# EAGLE design 477ProjectSchematic (EAGLE 6.4)
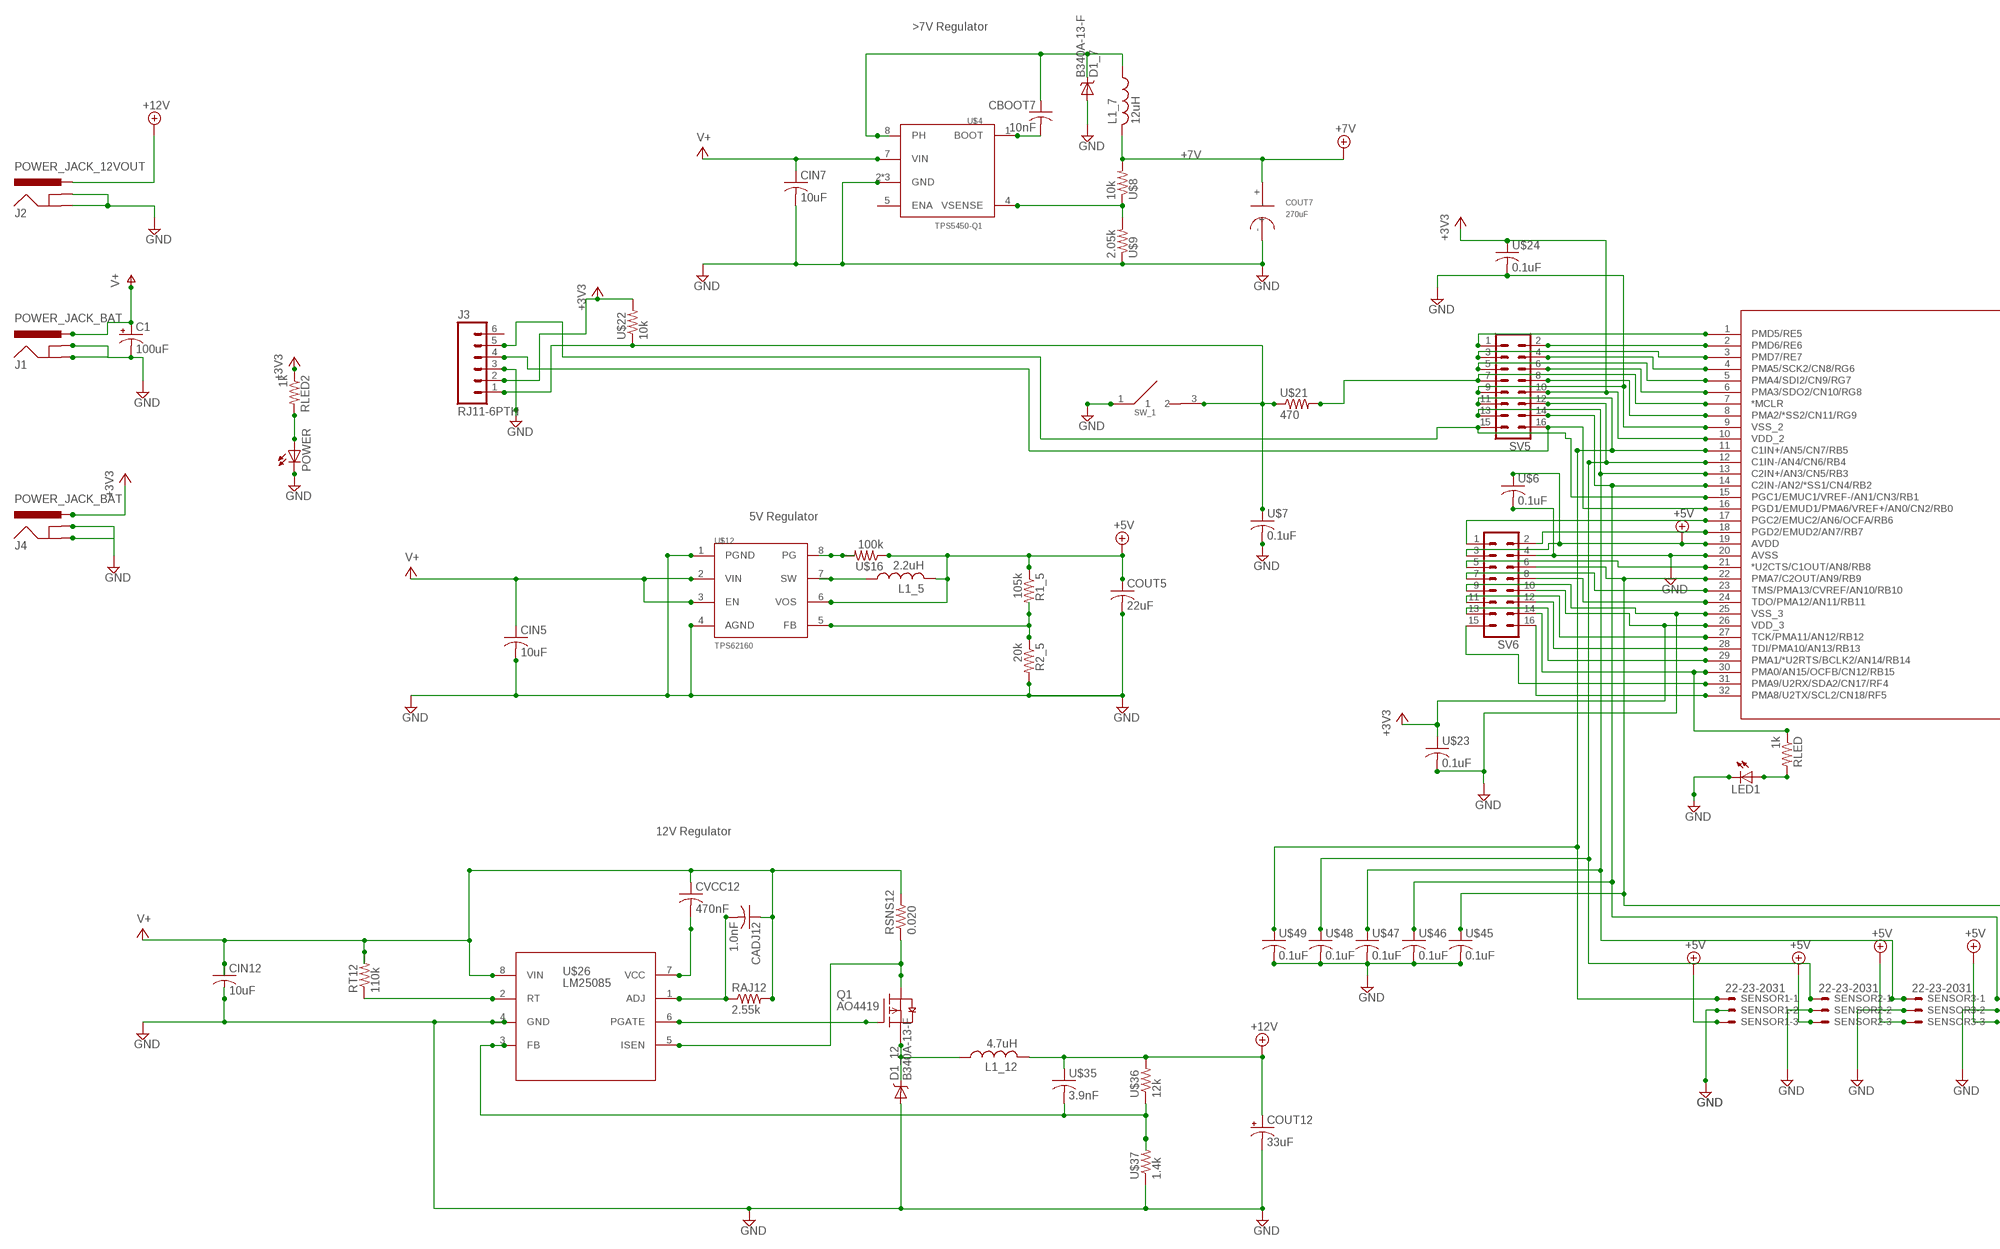
[diagram p0: schematic, sheet 1, part 1 of 2]
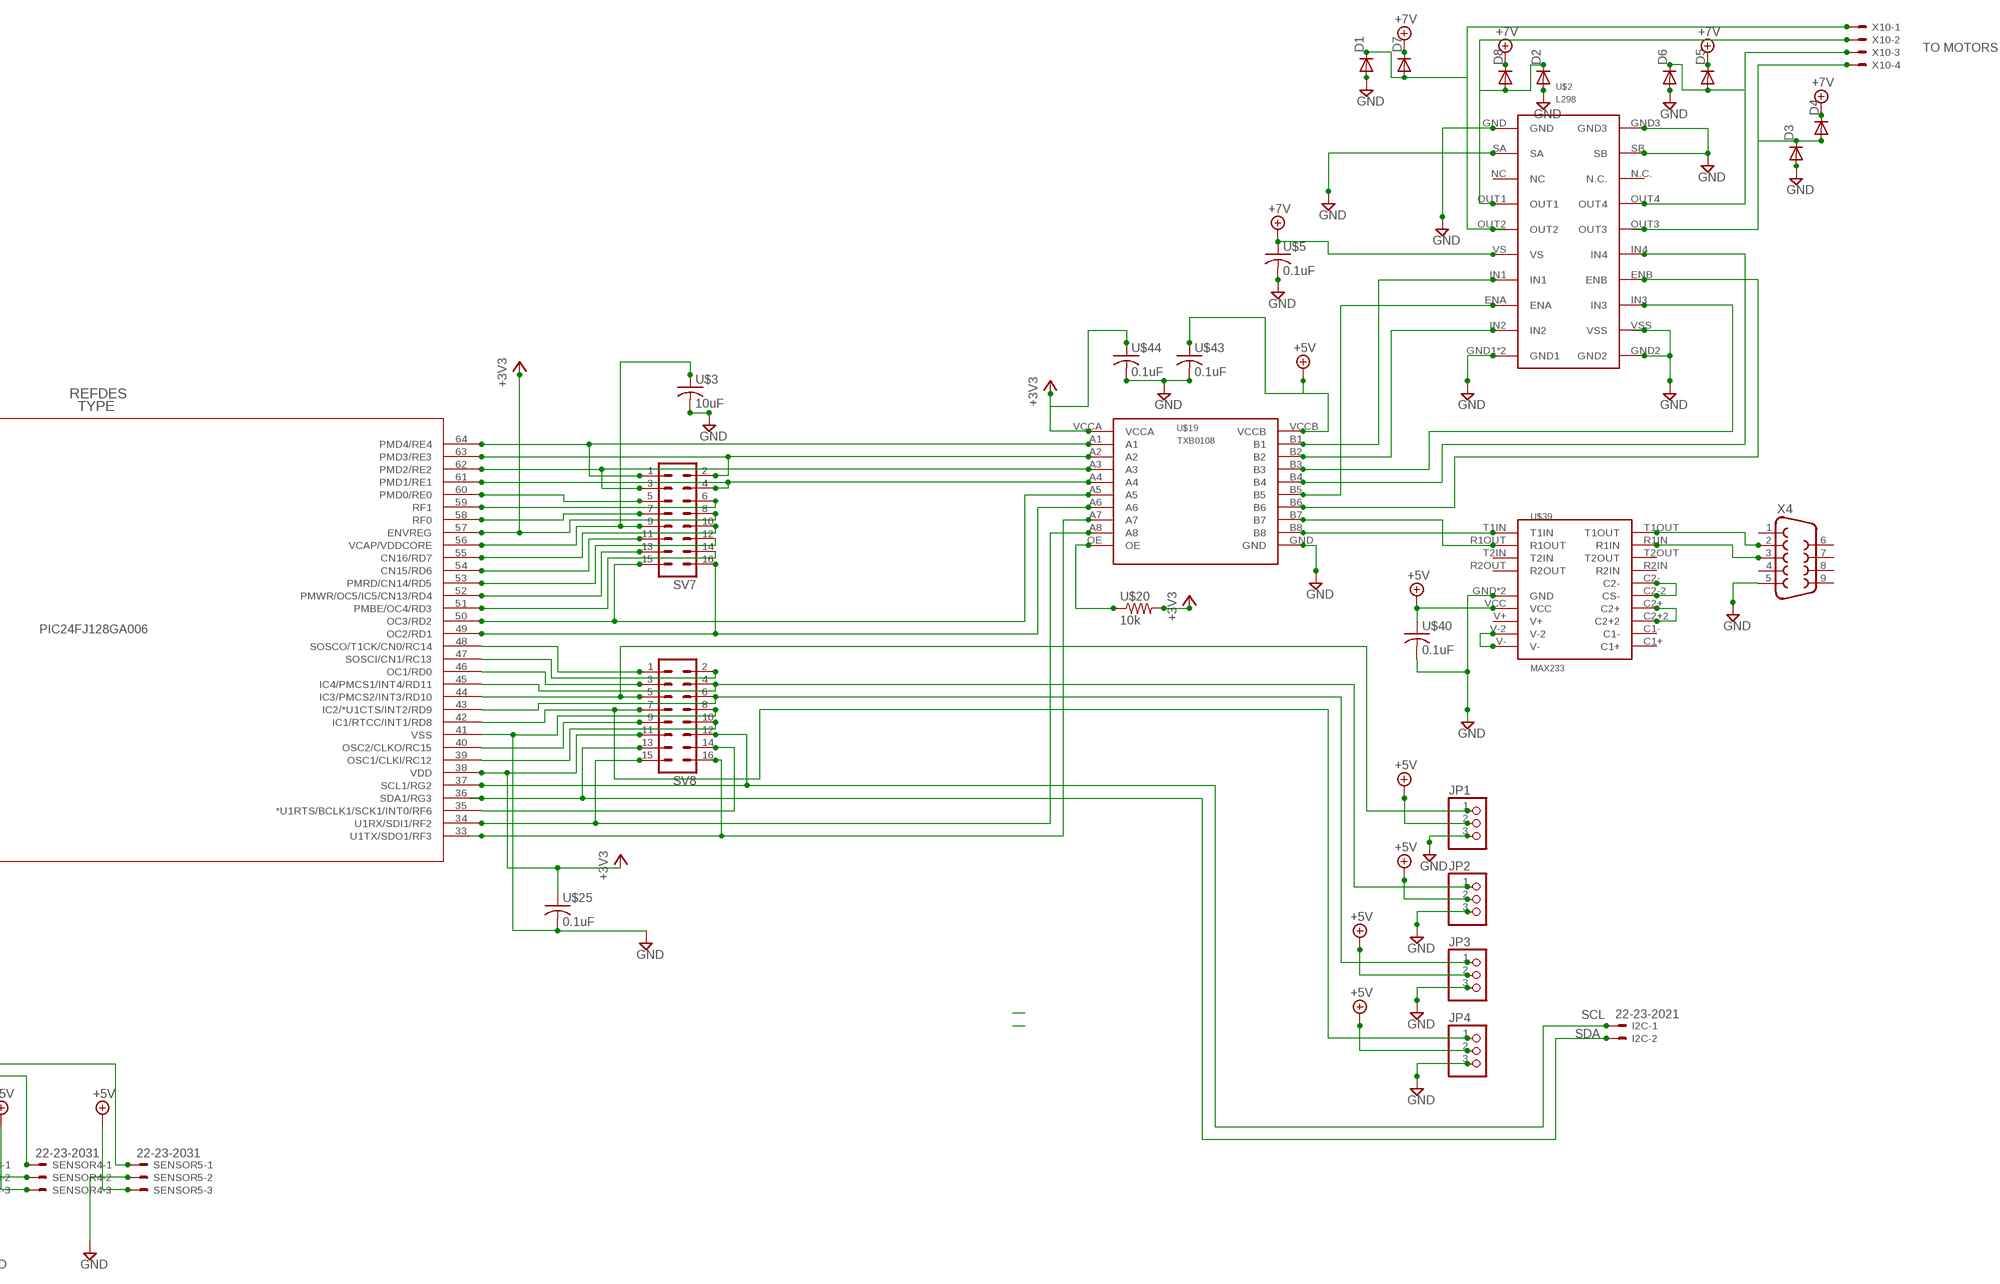
[diagram p1: schematic, sheet 1, part 2 of 2]

## Parts
C1  100uF  CPOL-USE3.5-8  [E3,5-8]
CADJ12  1.0nF  C-US-1206  [C1206]
CBOOT7  10nF  C-US-1206  [C1206]
CIN5  10uF  C-US-1206  [C1206]
CIN7  10uF  C-US-1210  [C1210]
CIN12  10uF  C-US-1210  [C1210]
COUT5  22uF  C-US-1206  [C1206]
COUT7  270uF  APXA100ARA271MJ80G  [CAPSMT_62_J80]
COUT12  33uF  T495D336K025ATE090  [D/7343-31W]
CVCC12  470nF  C-US-1206  [C1206]
D1  DIODE-DO-214AC  [DO-214AC]
D1_7  B340A-13-F  [SMA-DIODE]
D1_12  B340A-13-F  [SMA-DIODE]
D2  DIODE-DO-214AC  [DO-214AC]
D3  DIODE-DO-214AC  [DO-214AC]
D4  DIODE-DO-214AC  [DO-214AC]
D5  DIODE-DO-214AC  [DO-214AC]
D6  DIODE-DO-214AC  [DO-214AC]
D7  DIODE-DO-214AC  [DO-214AC]
D8  DIODE-DO-214AC  [DO-214AC]
I2C  22-23-2021  [22-23-2021]
J1  POWER_JACK_BAT  POWER_JACKPTH  [POWER_JACK_PTH]
J2  POWER_JACK_12VOUT  POWER_JACKPTH  [POWER_JACK_PTH]
J3  RJ11-6PTH  [RJ11-6]
J4  POWER_JACK_BAT  POWER_JACKPTH  [POWER_JACK_PTH]
JP1  PINHD-1X3  [1X03]
JP2  PINHD-1X3  [1X03]
JP3  PINHD-1X3  [1X03]
JP4  PINHD-1X3  [1X03]
L1_5  2.2uH  SDR0403  [SDR0403]
L1_7  12uH  SRR1210  [SRR1210]
L1_12  4.7uH  SLF10165T-4R7N4R73PF  [SLF10165]
LED1  LEDSMT1206  [1206]
POWER  LEDSMT1206  [1206]
Q1  AO4419  [SOIC8]
R1_5  105k  R-US"  [R1206]
R2_5  20k  R-US"  [R1206]
RAJ12  2.55k  R-US"  [R1206]
RLED  1k  R-US"  [R1206]
RLED2  1k  R-US"  [R1206]
RSNS12  0.020  R-US"  [R1206]
RT12  110k  R-US"  [R1206]
SENSOR1  22-23-2031  [22-23-2031]
SENSOR2  22-23-2031  [22-23-2031]
SENSOR3  22-23-2031  [22-23-2031]
SENSOR4  22-23-2031  [22-23-2031]
SENSOR5  22-23-2031  [22-23-2031]
SV5  MA08-2  [MA08-2]
SV6  MA08-2  [MA08-2]
SV7  MA08-2  [MA08-2]
SV8  MA08-2  [MA08-2]
SW_1  RESET_BUTTON  [TACTILE-PTH-12MM]
U$1  PIC24FJ128GA006-  [TQFP64_10X10MC]
U$2  L298  [L298]
U$3  10uF  C-US-1206  [C1206]
U$4  TPS5450-Q1  [PSOP-8]
U$5  0.1uF  C-US-1206  [C1206]
U$6  0.1uF  C-US-1206  [C1206]
U$7  0.1uF  C-US-1206  [C1206]
U$8  10k  R-US"  [R1206]
U$9  2.05k  R-US"  [R1206]
U$12  TPS62160  [MSOP-8]
U$16  100k  R-US"  [R1206]
U$19  TXB0108  [TXB0108]
U$20  10k  R-US"  [R1206]
U$21  470  R-US"  [R1206]
U$22  10k  R-US"  [R1206]
U$23  0.1uF  C-US-1206  [C1206]
U$24  0.1uF  C-US-1206  [C1206]
U$25  0.1uF  C-US-1206  [C1206]
U$26  LM25085  [MSOP-8]
U$35  3.9nF  C-US-1206  [C1206]
U$36  12k  R-US"  [R1206]
U$37  1.4k  R-US"  [R1206]
U$39  MAX233  [SOIC-20]
U$40  0.1uF  C-US-1206  [C1206]
U$43  0.1uF  C-US-1206  [C1206]
U$44  0.1uF  C-US-1206  [C1206]
U$45  0.1uF  C-US-1206  [C1206]
U$46  0.1uF  C-US-1206  [C1206]
U$47  0.1uF  C-US-1206  [C1206]
U$48  0.1uF  C-US-1206  [C1206]
U$49  0.1uF  C-US-1206  [C1206]
X4  DB9FEMALE  [DB9]
X10  22-23-2041  [22-23-2041]

## Nets
+3V3: J3.2 J4.PWR RLED2.1 SV5.10 SV6.10 SV7.8 SV8.11 U$1.10(VDD_2) U$1.26(VDD_3) U$1.38(VDD) U$1.57(ENVREG) U$19.VCCA U$20.2 U$22.2 U$23.1 U$24.1 U$25.1 U$44.1
+5V: COUT5.1 JP1.2 JP2.2 JP3.2 JP4.2 L1_5.B R1_5.1 SENSOR1.3 SENSOR2.3 SENSOR3.3 SENSOR4.3 SENSOR5.3 SV6.3 U$1.19(AVDD) U$6.1 U$12.6(VOS) U$16.1 U$19.VCCB U$39.VCC U$40.1 U$43.1
+7V: COUT7.+ D4.C D5.C D7.C D8.C L1_7.B U$2.VS U$5.1 U$8.2
+12V: COUT12.+ J2.PWR L1_12.2 U$35.1 U$36.2
GND: C1.- CIN5.2 CIN7.2 CIN12.2 COUT5.2 COUT7.- COUT12.- D1.A D1_7.- D1_12.- D2.A D3.A D6.A J1.GND J1.GNDBREAK J2.GND J2.GNDBREAK J3.3 J4.GND J4.GNDBREAK JP1.3 JP2.3 JP3.3 JP4.3 LED1.C POWER.C R2_5.2 SENSOR1.2 SENSOR2.2 SENSOR3.2 SENSOR4.2 SENSOR5.2 SV5.9 SV6.4 SV6.9 SV8.8 SW_1.1 U$1.9(VSS_2) U$1.20(AVSS) U$1.25(VSS_3) U$1.41(VSS) U$2.GND U$2.GND1 U$2.GND2 U$2.GND3 U$2.GNDPAD(GND1) U$2.SA U$2.SB U$2.VSS U$3.2 U$4.2(GND) U$4.6(GND) U$4.PAD(GND) U$5.2 U$6.2 U$7.2 U$9.1 U$12.1(PGND) U$12.4(AGND) U$19.GND U$23.2 U$24.2 U$25.2 U$26.4(GND) U$37.1 U$39.GND U$39.GND2(GND) U$40.2 U$43.2 U$44.2 U$45.2 U$46.2 U$47.2 U$48.2 U$49.2 X4.5
N$1: SENSOR1.1 SV5.11 U$1.11(C1IN+/AN5/CN7/RB5) U$49.1
N$2: SENSOR2.1 SV5.12 U$1.12(C1IN-/AN4/CN6/RB4) U$48.1
N$3: SENSOR3.1 SV5.13 U$1.13(C2IN+/AN3/CN5/RB3) U$47.1
N$4: SENSOR4.1 SV5.14 U$1.14(C2IN-/AN2/*SS1/CN4/RB2) U$46.1
N$5: SENSOR5.1 SV6.6 U$1.22(PMA7/C2OUT/AN9/RB9) U$45.1
N$6: SV5.1 U$1.1(PMD5/RE5)
N$7: J3.4 SV5.16 U$1.16(PGD1/EMUD1/PMA6/VREF+/AN0/CN2/RB0)
N$8: SV8.15 U$1.34(U1RX/SDI1/RF2) U$19.A8
N$9: SV8.16 U$1.33(U1TX/SDO1/RF3) U$19.A7
N$10: SV6.1 U$1.17(PGC2/EMUC2/AN6/OCFA/RB6)
N$11: SV5.2 U$1.2(PMD6/RE6)
N$12: JP3.1 SV8.6 U$1.43(IC2/*U1CTS/INT2/RD9)
N$13: U$39.V- U$39.V-2
N$14: J3.5 SV5.15 U$1.15(PGC1/EMUC1/VREF-/AN1/CN3/RB1)
N$15: SV7.1 U$1.64(PMD4/RE4) U$19.A1
N$16: CBOOT7.1 D1_7.+ L1_7.A U$4.8(PH)
N$17: SV7.2 U$1.63(PMD3/RE3) U$19.A2
N$18: D2.C D8.A U$2.OUT1 X10.2
N$19: D1.C D7.A U$2.OUT2 X10.1
N$20: D5.A D6.C U$2.OUT4 X10.3
N$21: D3.C D4.A U$2.OUT3 X10.4
N$22: SV6.2 U$1.18(PGD2/EMUD2/AN7/RB7)
N$23: SV5.3 U$1.3(PMD7/RE7)
N$24: SV5.4 U$1.4(PMA5/SCK2/CN8/RG6)
N$25: CBOOT7.2 U$4.1(BOOT)
N$26: SV5.5 U$1.5(PMA4/SDI2/CN9/RG7)
N$27: SV5.6 U$1.6(PMA3/SDO2/CN10/RG8)
N$28: U$4.4(VSENSE) U$8.1 U$9.2
N$29: SV7.3 U$1.62(PMD2/RE2) U$19.A3
N$30: J3.1 SW_1.3 U$7.1 U$21.1 U$22.1
N$31: LED1.A RLED.2
N$32: SV7.4 U$1.61(PMD1/RE1) U$19.A4
N$33: D1_12.+ L1_12.1 Q1.1(S) Q1.2(S) Q1.3(S)
N$34: SV7.15 U$1.50(OC3/RD2) U$19.A5
N$35: U$26.3(FB) U$35.2 U$36.1 U$37.2
N$36: L1_5.A U$12.7(SW)
N$37: U$12.8(PG) U$16.2
N$38: SV7.16 U$1.49(OC2/RD1) U$19.A6
N$39: U$2.IN1 U$19.B1
N$40: R1_5.2 R2_5.1 U$12.5(FB)
N$41: U$2.IN4 U$19.B4
N$42: U$2.IN2 U$19.B2
N$43: U$2.IN3 U$19.B3
N$44: U$2.ENA U$19.B5
N$45: U$2.ENB U$19.B6
N$46: SV6.5 U$1.21(*U2CTS/C1OUT/AN8/RB8)
N$47: U$19.B7 U$39.R1OUT
N$48: RT12.1 U$26.2(RT)
N$49: U$19.B8 U$39.T1IN
N$51: CVCC12.2 U$26.7(VCC)
N$52: CADJ12.2 RAJ12.1 U$26.1(ADJ)
N$53: U$39.T1OUT X4.2
N$54: Q1.5(D) Q1.6(D) Q1.7(D) Q1.8(D) RSNS12.1 U$26.5(ISEN)
N$55: Q1.4(G) U$26.6(PGATE)
N$56: U$19.OE U$20.1
N$57: SV6.7 U$1.23(TMS/PMA13/CVREF/AN10/RB10)
N$59: SV8.1 U$1.48(SOSCO/T1CK/CN0/RC14)
N$61: SV6.8 U$1.24(TDO/PMA12/AN11/RB11)
N$62: U$39.C2- U$39.C2-2(CS-)
N$63: SV6.11 U$1.27(TCK/PMA11/AN12/RB12)
N$64: SV6.12 U$1.28(TDI/PMA10/AN13/RB13)
N$65: SV6.13 U$1.29(PMA1/*U2RTS/BCLK2/AN14/RB14)
N$66: RLED.1 SV6.14 U$1.30(PMA0/AN15/OCFB/CN12/RB15)
N$67: SV7.9 U$1.56(VCAP/VDDCORE) U$3.1
N$68: SV8.2 U$1.47(SOSCI/CN1/RC13)
N$69: SV8.3 U$1.46(OC1/RD0)
N$70: JP2.1 SV8.4 U$1.45(IC4/PMCS1/INT4/RD11)
N$71: JP1.1 SV8.5 U$1.44(IC3/PMCS2/INT3/RD10)
N$72: U$39.C2+ U$39.C2+2
N$73: JP4.1 SV8.7 U$1.42(IC1/RTCC/INT1/RD8)
N$74: SV8.9 U$1.40(OSC2/CLKO/RC15)
N$75: SV8.10 U$1.39(OSC1/CLKI/RC12)
N$76: SV7.11 U$1.54(CN15/RD6)
N$77: SV7.12 U$1.53(PMRD/CN14/RD5)
N$78: POWER.A RLED2.2
N$79: SV5.7 U$1.7(*MCLR) U$21.2
N$81: SV7.13 U$1.52(PMWR/OC5/IC5/CN13/RD4)
N$82: SV7.14 U$1.51(PMBE/OC4/RD3)
N$83: SV8.14 U$1.35(*U1RTS/BCLK1/SCK1/INT0/RF6)
N$87: U$39.R1IN X4.3
N$90: SV6.15 U$1.31(PMA9/U2RX/SDA2/CN17/RF4)
N$91: SV5.8 U$1.8(PMA2/*SS2/CN11/RG9)
N$93: SV6.16 U$1.32(PMA8/U2TX/SCL2/CN18/RF5)
N$94: SV7.10 U$1.55(CN16/RD7)
N$95: SV7.7 U$1.58(RF0)
N$96: SV7.6 U$1.59(RF1)
N$97: SV7.5 U$1.60(PMD0/RE0)
SCL: I2C.1 SV8.12 U$1.37(SCL1/RG2)
SDA: I2C.2 SV8.13 U$1.36(SDA1/RG3)
V+: C1.+ CADJ12.1 CIN5.1 CIN7.1 CIN12.1 CVCC12.1 J1.PWR RAJ12.2 RSNS12.2 RT12.2 U$4.7(VIN) U$12.2(VIN) U$12.3(EN) U$26.8(VIN)
Unconnected: J3.6 U$2.N.C. U$2.NC U$4.5(ENA) U$39.C1+ U$39.C1- U$39.R2IN U$39.R2OUT U$39.T2IN U$39.T2OUT U$39.V+ X4.1 X4.4 X4.6 X4.7 X4.8 X4.9

## Notes on the sheet
- TO MOTORS
- >7V Regulator
- PIC24FJ128GA006
- 5V Regulator
- 12V Regulator
- SCL
- SDA

## Library data of the parts
C1 = rcl:CPOL-US: POLARIZED CAPACITOR, American symbol
CADJ12 CBOOT7 CIN5 COUT5 CVCC12 U$3 U$5-U$7 U$23-U$25 U$35 U$40 U$43-U$49 = MinotaurParts:C-US-1206
CIN7 CIN12 = MinotaurParts:C-US-1210
COUT7 = MinotaurParts:APXA100ARA271MJ80G
COUT12 = MinotaurParts:T495D336K025ATE090: Tantalum capacitor for 12 volt power circuit
D1-D8 = diode:DIODE-: DIODE
D1_7 D1_12 = MinotaurParts:B340A-13-F
I2C = con-molex:22-23-2021: .100" (2.54mm) Center Header - 2 Pin; MF: MOLEX; MPN: 22-23-2021; OC_FARNELL: 1462926; OC_NEWARK: 25C3832
J1 J2 J4 = SparkFun-Connectors:POWER_JACK: Power Jack This is the standard 5.5mm barrel jack for power. The PTH is the most common, proven, reliable, footprint. The Slot footprint only works if the mill layer is transmitted to the PCB fab house so be warned. Spark Fun Electronics SKU : PRT-00119 SMT: CONN-08106 Mating wall wart : TOL-00298 (and others)
J3 = SparkFun-Connectors:RJ11-6: RJ11 Jack Simple 6 pin RJ11 jack. Commonly found on CAT3 devices and Microchip programmers. SKU: PRT-00132
JP1-JP4 = pinhead:PINHD-1X3: PIN HEADER
L1_5 = MinotaurParts:SDR0403
L1_7 = MinotaurParts:SRR1210
L1_12 = MinotaurParts:SLF10165T-4R7N4R73PF: Inductor for the 12V power circuit
LED1 POWER = led:LED: LED OSRAM: - CHIPLED LG R971, LG N971, LY N971, LG Q971, LY Q971, LO R971, LY R971 LH N974, LH R974 LS Q976, LO Q976, LY Q976 LO Q996 - Hyper CHIPLED LW Q18S LB Q993, LB Q99A, LB R99A - SideLED LS A670, LO A670, LY A670, LG A670, LP A670 LB A673, LV A673, LT A673, LW A673 LH A674 LY A675 LS A676, LA A676, LO A676, LY A676, LW A676 LS A679, LY A679, LG A679 - Hyper Micro SIDELED® LS Y876, LA Y876, LO Y876, LY Y876 LT Y87S - SmartLED LW L88C, LW L88S LB L89C, LB L89S, LG L890 LS L89K, LO L89K, LY L89K LS L896, LA L896, LO L896, LY L896 - TOPLED LS T670, LO T670, LY T670, LG T670, LP T670 LSG T670, LSP T670, LSY T670, LOP T670, LYG T670 LG T671, LOG T671, LSG T671 LB T673, LV T673, LT T673, LW T673 LH T674 LS T676, LA T676, LO T676, LY T676, LB T676, LH T676, LSB T676, LW T676 LB T67C, LV T67C, LT T67C, LS T67K, LO T67K, LY T67K, LW E67C LS E67B, LA E67B, LO E67B, LY E67B, LB E67C, LV E67C, LT E67C LW T67C LS T679, LY T679, LG T679 LS T770, LO T770, LY T770, LG T770, LP T770 LB T773, LV T773, LT T773, LW T773 LH T774 LS E675, LA E675, LY E675, LS T675 LS T776, LA T776, LO T776, LY T776, LB T776 LHGB T686 LT T68C, LB T68C - Hyper Mini TOPLED® LB M676 - Mini TOPLED Santana® LG M470 LS M47K, LO M47K, LY M47K Source: http://www.osram.convergy.de LUXEON: - LUMILED® LXK2-PW12-R00, LXK2-PW12-S00, LXK2-PW14-U00, LXK2-PW14-V00 LXK2-PM12-R00, LXK2-PM12-S00, LXK2-PM14-U00 LXK2-PE12-Q00, LXK2-PE12-R00, LXK2-PE12-S00, LXK2-PE14-T00, LXK2-PE14-U00 LXK2-PB12-K00, LXK2-PB12-L00, LXK2-PB12-M00, LXK2-PB14-N00, LXK2-PB14-P00, LXK2-PB14-Q00 LXK2-PR12-L00, LXK2-PR12-M00, LXK2-PR14-Q00, LXK2-PR14-R00 LXK2-PD12-Q00, LXK2-PD12-R00, LXK2-PD12-S00 LXK2-PH12-R00, LXK2-PH12-S00 LXK2-PL12-P00, LXK2-PL12-Q00, LXK2-PL12-R00 Source: www.luxeon.com KINGBRIGHT: KA-3528ASYC Source: www.kingbright.com
Q1 = MinotaurParts:AO4419: P-Channel MOSFET -30V; -9.7A; USE IN 12V regulator circuit
R1_5 R2_5 RAJ12 RLED RLED2 RSNS12 RT12 U$8 U$9 U$16 U$20-U$22 U$36 U$37 = MinotaurParts:R-US: Surface mount resistor
SENSOR1-SENSOR5 = con-molex:22-23-2031: .100" (2.54mm) Center Header - 3 Pin; MF: MOLEX; MPN: 22-23-2031; OC_FARNELL: 1462950; OC_NEWARK: 30C0862
SV5-SV8 = con-lstb:MA08-2: PIN HEADER; OC_FARNELL: unknown; OC_NEWARK: unknown
SW_1 = MinotaurParts:RESET_BUTTON
U$1 = MinotaurParts:PIC24FJ128GA006-
U$2 = MinotaurParts:L298: H bridge motor driver
U$4 = MinotaurParts:TPS5450-Q1
U$12 = MinotaurParts:TPS62160: adjustable switching regulator for the 3.3 volt and 5 volt rails
U$19 = MinotaurParts:TXB0108: 3.3 - 5 volt level converter
U$26 = MinotaurParts:LM25085
U$39 = MinotaurParts:MAX233: RS232 level converter
X4 = SparkFun-Connectors:DB9: DB9 Connector Standard DB9 (D-Sub 9) serial connector. Can be used for CAN bus as well as RS485 and RS232. Footprint production proven. Spark Fun Electronics SKU : PRT-00429
X10 = con-molex:22-23-2041: .100" (2.54mm) Center Header - 4 Pin; MF: MOLEX; MPN: 22-23-2041; OC_FARNELL: 1462920; OC_NEWARK: 38C0355

## Board
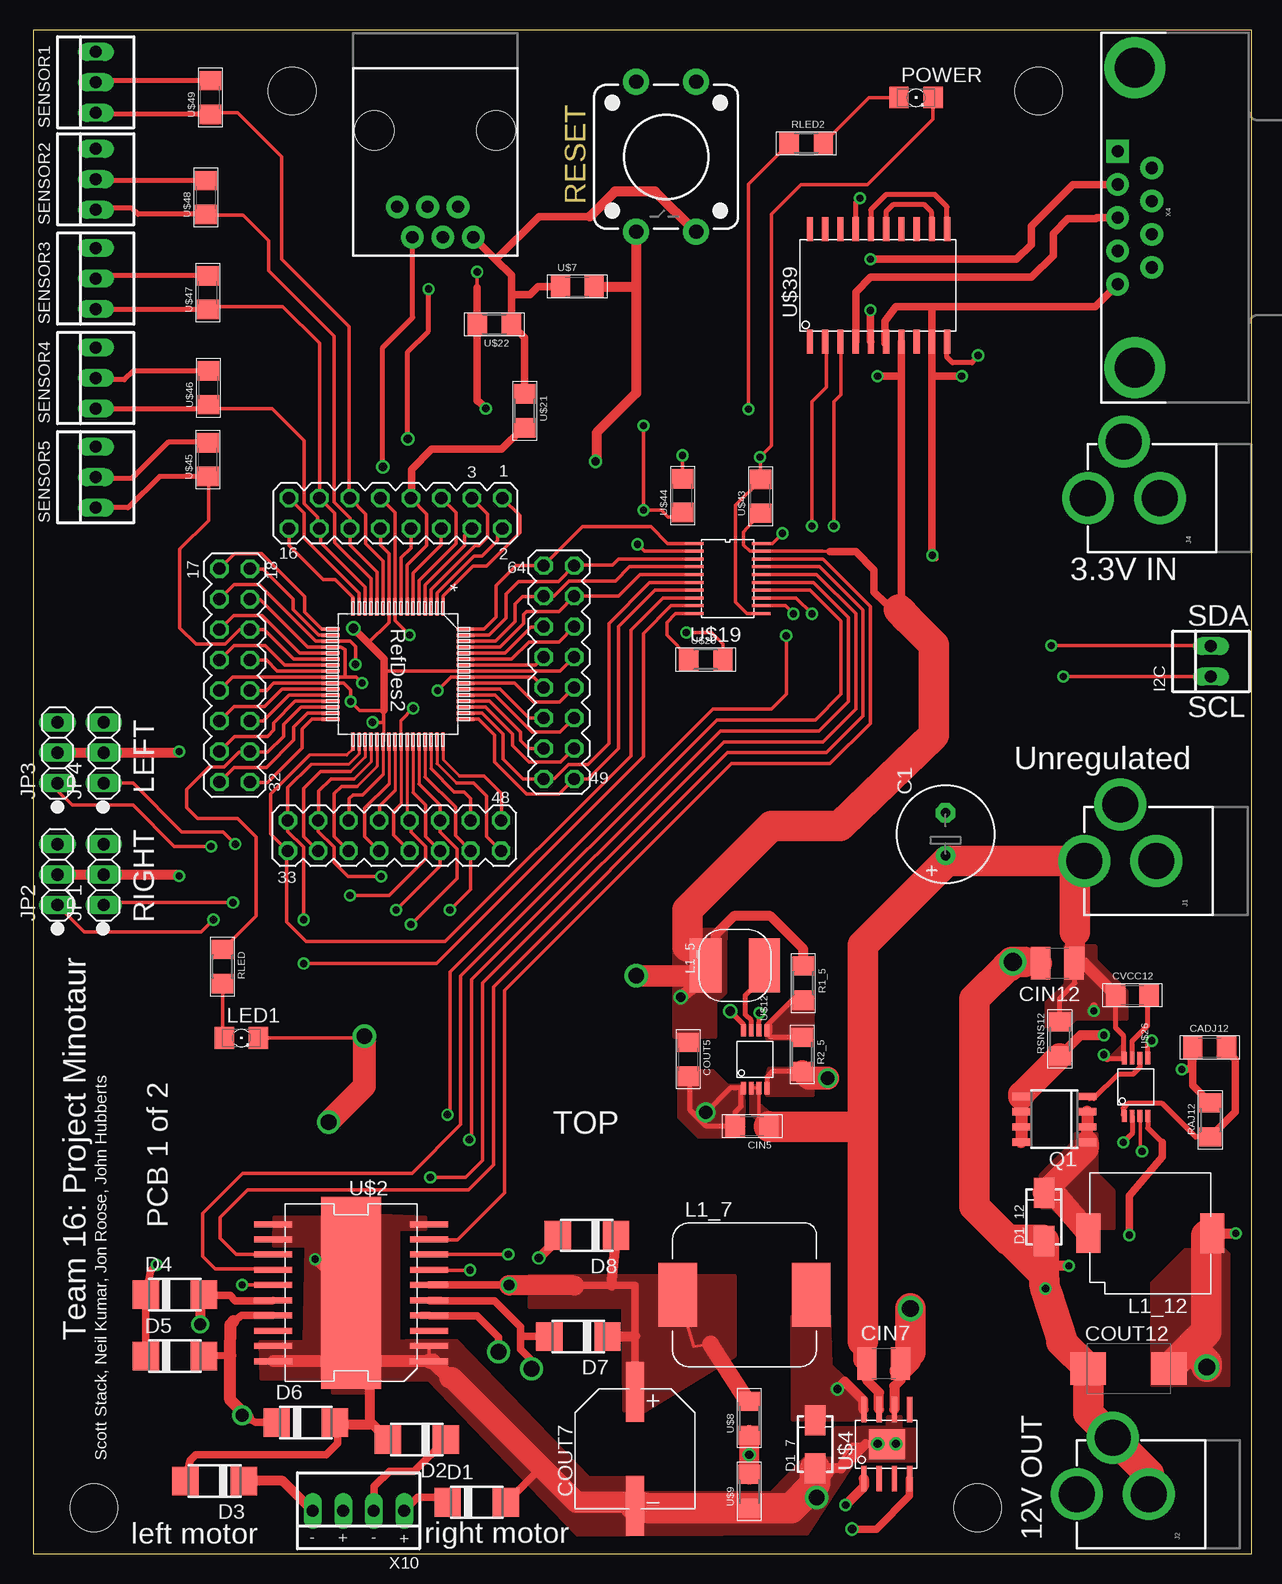
[diagram p2: board, top side]
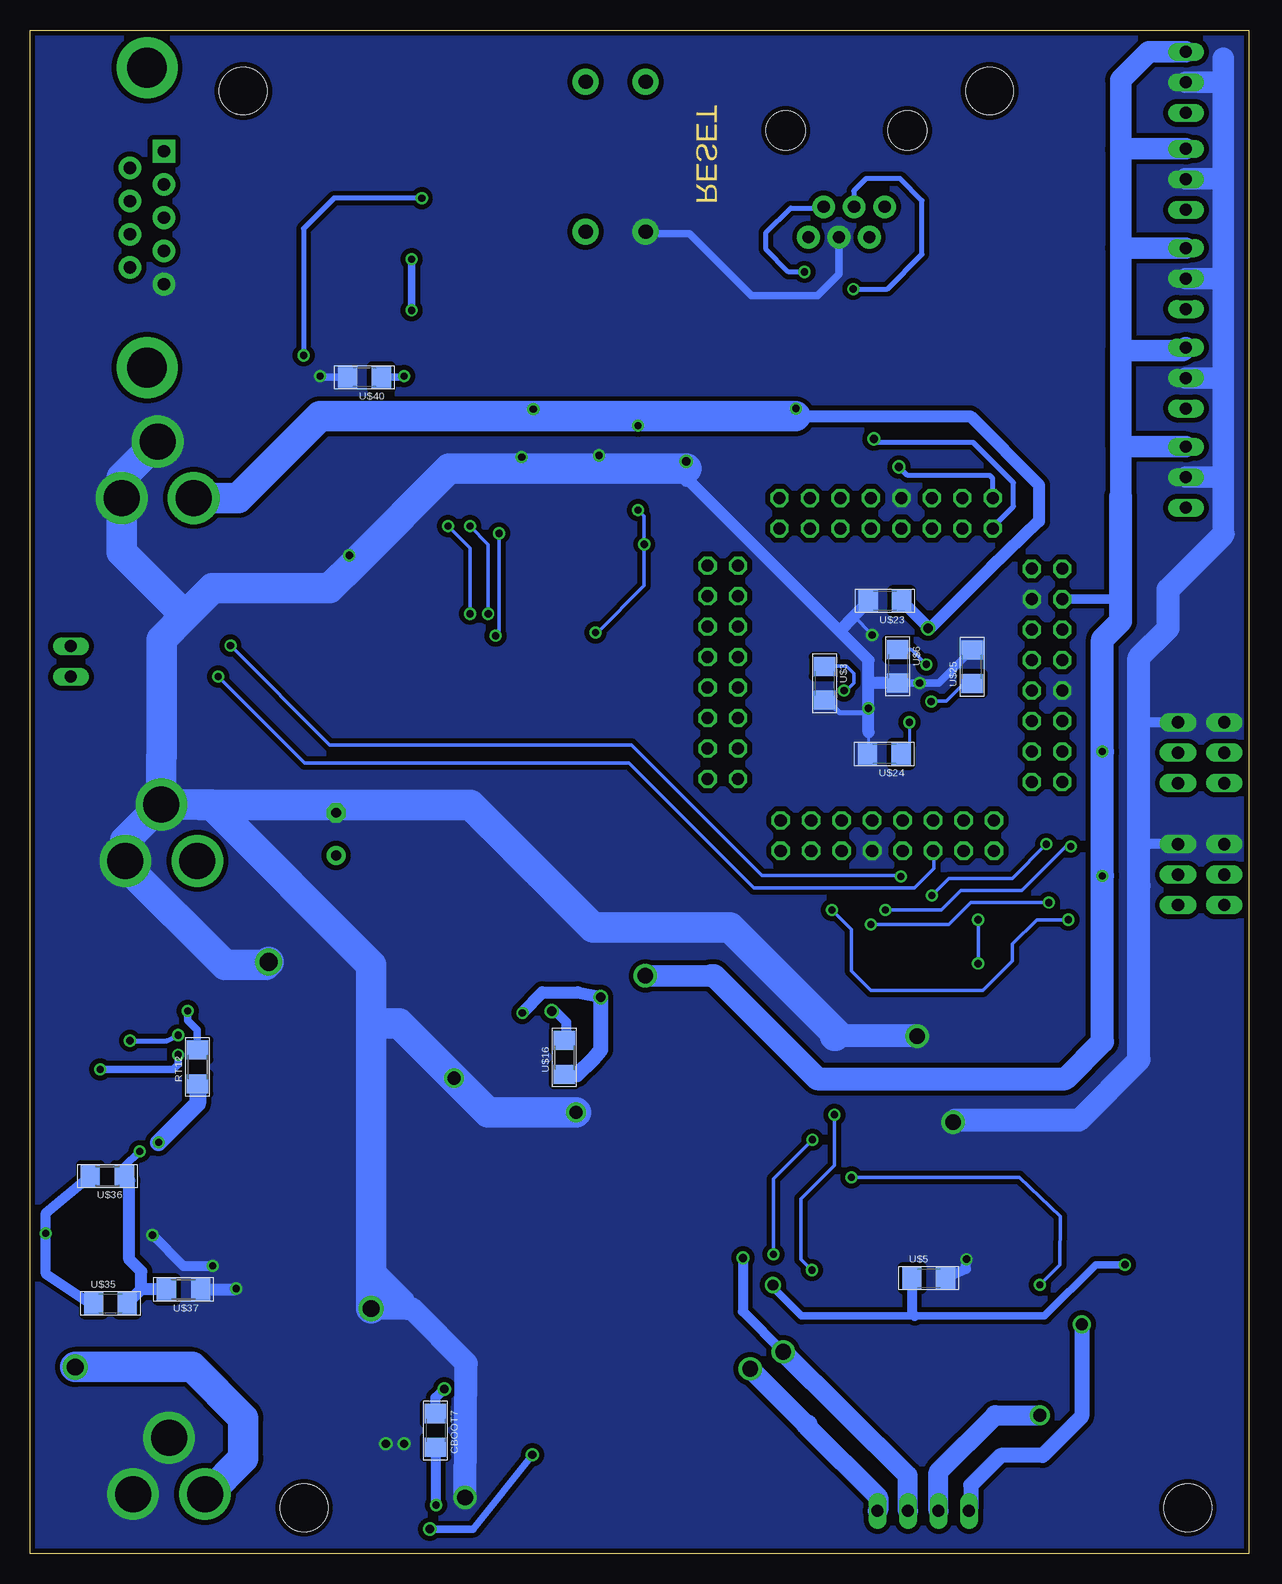
[diagram p3: board, bottom side, seen from below]

Size 101.6 x 127 mm. Coordinates in mm from the lower left corner, seen from the top.
Outline: 0,0 101.6,0 101.6,127 0,127 0,0
Copper layers (1*16): Top 0.035mm / dielectric 1.5mm / Bottom 0.035mm
Design rules "default *": minimum track width 8mil, minimum drill 8mil, track to track 7mil, track to pad 7mil, pad to pad 7mil, via to via 7mil, smd to smd 7mil, copper to edge 10mil, drill to drill 8mil, minimum pad ring 10mil, minimum via ring 8mil, stop-mask expansion 4mil, vias tented up to drill 0mil, thermal gap 10mil
Holes 3.96 mm at 83.82,121.92 21.59,121.92 78.74,3.81 5.08,3.81

### Footprints (pad centres in the part's own frame; a part is rotated, then mirrored left to right if it is on the bottom)
E3,5-8 = drill 0.813 pad 1.6: + -1.778,0 | drill 0.813 pad 1.6 octagon: - 1.778,0
C1206 = smd 1.6 x 1.8: 1 -1.4,0; 2 1.4,0
C1210 = smd 1.6 x 2.7: 1 -1.4,0; 2 1.4,0
CAPSMT_62_J80 = smd 1.5 x 5: + 0,4.75; - 0,-4.75
D/7343-31W = smd 2.95 x 2.7: + 3.375,0; - -3.375,0
DO-214AC = smd 2.2 x 2.4: A 2.425,0; C -2.425,0
SMA-DIODE = smd 2.5 x 1.7: + 2,0; - -2,0
22-23-2021 = drill 1 long: 1 -1.27,0; 2 1.27,0
POWER_JACK_PTH = drill 2.997 pad 4.318: GND 0,7.7; GNDBREAK 4.7,10.7; PWR 0,13.7
RJ11-6 = drill 1.016 pad 1.88: 1 1.905,8.89; 2 3.175,6.35; 3 4.445,8.89; 4 5.715,6.35; 5 6.985,8.89; 6 8.255,6.35 | hole 3.251: 0,0; 10.16,0
1X03 = drill 1.016 long: 1 -2.54,0; 2 0,0; 3 2.54,0
SDR0403 = smd 4.5 x 2.6: A 0,2.45; B 0,-2.45
SRR1210 = smd 5.3 x 3.2: A 0,5.55; B 0,-5.55
SLF10165 = smd 3.3 x 2: 1 0,5.15; 2 0,-5.15
1206 = smd 1.6 x 1.803: A -1.422,0; C 1.422,0
SOIC8 = smd 0.6 x 1.5: 1 -1.905,-2.75; 2 -0.635,-2.75; 3 0.635,-2.75; 4 1.905,-2.75; 5 1.905,2.75; 6 0.635,2.75; 7 -0.635,2.75; 8 -1.905,2.75
R1206 = smd 1.6 x 1.803: 1 -1.422,0; 2 1.422,0
22-23-2031 = drill 1 long: 1 -2.54,0; 2 0,0; 3 2.54,0
MA08-2 = drill 1.016 octagon: 1 -8.89,-1.27; 2 -8.89,1.27; 3 -6.35,-1.27; 4 -6.35,1.27; 5 -3.81,-1.27; 6 -3.81,1.27; 7 -1.27,-1.27; 8 -1.27,1.27; 9 1.27,-1.27; 10 1.27,1.27; 11 3.81,-1.27; 12 3.81,1.27; 13 6.35,-1.27; 14 6.35,1.27; 15 8.89,-1.27; 16 8.89,1.27
TACTILE-PTH-12MM = drill 1.2 pad 2.159: 1 6.25,-2.5; 2 -6.25,-2.5; 3 6.25,2.5; 4 -6.25,2.5
TQFP64_10X10MC = smd 1.473 x 0.279: 1 -5.613,3.759; 2 -5.613,3.251; 3 -5.613,2.743; 4 -5.613,2.261; 5 -5.613,1.753; 6 -5.613,1.245; 7 -5.613,0.762; 8 -5.613,0.254; 9 -5.613,-0.254; 10 -5.613,-0.762; 11 -5.613,-1.245; 12 -5.613,-1.753; 13 -5.613,-2.261; 14 -5.613,-2.743; 15 -5.613,-3.251; 16 -5.613,-3.759; 33 5.613,-3.759; 34 5.613,-3.251; 35 5.613,-2.743; 36 5.613,-2.261; 37 5.613,-1.753; 38 5.613,-1.245; 39 5.613,-0.762; 40 5.613,-0.254; 41 5.613,0.254; 42 5.613,0.762; 43 5.613,1.245; 44 5.613,1.753; 45 5.613,2.261; 46 5.613,2.743; 47 5.613,3.251; 48 5.613,3.759 | smd 0.279 x 1.473: 17 -3.759,-5.613; 18 -3.251,-5.613; 19 -2.743,-5.613; 20 -2.261,-5.613; 21 -1.753,-5.613; 22 -1.245,-5.613; 23 -0.762,-5.613; 24 -0.254,-5.613; 25 0.254,-5.613; 26 0.762,-5.613; 27 1.245,-5.613; 28 1.753,-5.613; 29 2.261,-5.613; 30 2.743,-5.613; 31 3.251,-5.613; 32 3.759,-5.613; 49 3.759,5.613; 50 3.251,5.613; 51 2.743,5.613; 52 2.261,5.613; 53 1.753,5.613; 54 1.245,5.613; 55 0.762,5.613; 56 0.254,5.613; 57 -0.254,5.613; 58 -0.762,5.613; 59 -1.245,5.613; 60 -1.753,5.613; 61 -2.261,5.613; 62 -2.743,5.613; 63 -3.251,5.613; 64 -3.759,5.613
L298 = smd 0.5 x 3.2: ENA 3.175,-6.5; ENB 1.905,6.5; GND -5.715,-6.5; GND1 5.715,-6.5; GND2 5.715,6.5; GND3 -5.715,6.5; IN1 1.905,-6.5; IN2 4.445,-6.5; IN3 3.175,6.5; IN4 0.635,6.5; N.C. -3.175,6.5; NC -3.175,-6.5; OUT1 -1.905,-6.5; OUT2 -0.635,-6.5; OUT3 -0.635,6.5; OUT4 -1.905,6.5; SA -4.445,-6.5; SB -4.445,6.5; VS 0.635,-6.5; VSS 4.445,6.5 | smd 16 x 5: GNDPAD 0,0
PSOP-8 = smd 0.45 x 2.15: 1 -1.905,-2.875; 2 -0.635,-2.875; 3 0.635,-2.875; 4 1.905,-2.875; 5 1.905,2.875; 6 0.635,2.875; 7 -0.635,2.875; 8 -1.905,2.875 | smd 3 x 2.49: PAD 0,0
MSOP-8 = smd 0.41 x 1.02: 1 -0.975,-2.4; 2 -0.325,-2.4; 3 0.325,-2.4; 4 0.975,-2.4; 5 0.975,2.4; 6 0.325,2.4; 7 -0.325,2.4; 8 -0.975,2.4
TXB0108 = smd 0.25 x 1.55: A1 -2.925,-2.8; A2 -1.625,-2.8; A3 -0.975,-2.8; A4 -0.325,-2.8; A5 0.325,-2.8; A6 0.975,-2.8; A7 1.625,-2.8; A8 2.275,-2.8; B1 -2.925,2.8; B2 -1.625,2.8; B3 -0.975,2.8; B4 -0.325,2.8; B5 0.325,2.8; B6 0.975,2.8; B7 1.625,2.8; B8 2.275,2.8; GND 2.925,2.8; OE 2.925,-2.8; VCCA -2.275,-2.8; VCCB -2.275,2.8
SOIC-20 = smd 0.53 x 1.98: C1+ 2.54,4.685; C1- 1.27,4.685; C2+ 0,4.685; C2+2 3.81,4.685; C2- -1.27,4.685; C2-2 5.08,4.685; GND 0,-4.685; GND2 3.81,-4.685; R1IN -2.54,-4.685; R1OUT -3.81,-4.685; R2IN -5.08,4.685; R2OUT -6.35,4.685; T1IN -5.08,-4.685; T1OUT -1.27,-4.685; T2IN -6.35,-4.685; T2OUT -3.81,4.685; V+ 2.54,-4.685; V- 5.08,-4.685; V-2 -2.54,4.685; VCC 1.27,-4.685
DB9 = drill 1.016 pad 1.88 square: 1 -5.54,-1.42 | drill 1.016 pad 1.88: 2 -2.77,-1.42; 3 0,-1.42; 4 2.77,-1.42; 5 5.54,-1.42; 6 -4.15,1.42; 7 -1.38,1.42; 8 1.38,1.42; 9 4.15,1.42 | drill 3.302 pad 5.08: G1 -12.5,0; G2 12.5,0
22-23-2041 = drill 1 long: 1 -3.81,0; 2 -1.27,0; 3 1.27,0; 4 3.81,0

### Placement (x,y rotation side)
C1  76.07,59.97 90 top
CADJ12  98.09,42.19 0 top
CBOOT7  67.79,10.26 270 bottom
CIN5  59.94,35.61 180 top
CIN7  70.92,15.85 0 top
CIN12  85.39,49.2 180 top
COUT5  54.61,41.2 270 top
COUT7  50.19,8.74 0 top
COUT12  91.34,15.42 0 top
CVCC12  91.64,46.56 0 top
D1  36.98,4.27 0 top
D1_7  65.2,9.12 90 top
D1_12  84.28,28.07 90 top
D2  32,9.5 180 top
D3  15.14,6.05 180 top
D4  11.84,21.59 0 top
D5  11.84,16.46 0 top
D6  22.73,10.92 0 top
D7  45.47,18.08 180 top
D8  46.18,26.52 180 top
I2C  98.2,74.37 90 top
J1  101.35,57.73 90 top
J2  100.71,4.95 90 top
J3  38.61,118.62 180 top
J4  101.65,87.99 90 top
JP1  5.89,56.59 90 top
JP2  2.03,56.59 90 top
JP3  2.03,66.75 90 top
JP4  5.89,66.75 90 top
L1_5  58.52,49.02 270 top
L1_7  59.31,21.56 270 top
L1_12  93.14,26.7 90 top
LED1  17.37,42.98 0 top
POWER  73.61,121.36 0 top
Q1  85.14,36.2 90 top
R1_5  64.21,47.55 270 top
R2_5  64.11,41.61 270 top
RAJ12  98.15,36.14 90 top
RLED  15.8,48.92 270 top
RLED2  64.47,117.55 0 top
RSNS12  85.6,42.9 90 top
RT12  87.63,40.56 90 bottom
SENSOR1  5.23,122.63 90 top
SENSOR2  5.23,114.55 90 top
SENSOR3  5.23,106.27 90 top
SENSOR4  5.23,97.99 90 top
SENSOR5  5.23,89.71 90 top
SV5  30.23,86.72 180 top
SV6  16.81,73.2 270 top
SV7  43.84,73.46 270 top
SV8  30.12,59.84 180 top
SW_1  52.78,116.43 270 top
U$1  30.43,73.3 270 top
U$2  26.52,21.74 90 top
U$3  35.36,72.54 270 bottom
U$4  71.17,9.12 0 top
U$5  26.67,22.96 0 bottom
U$6  29.26,73.96 270 bottom
U$7  45.36,105.61 0 top
U$8  59.72,11.28 90 top
U$9  59.72,5.18 90 top
U$12  60.2,41.2 0 top
U$16  57.05,41.35 90 bottom
U$19  57.91,81.28 270 top
U$20  56.08,74.52 0 top
U$21  41,95.25 270 top
U$22  38.46,102.46 180 top
U$23  30.33,79.4 180 bottom
U$24  30.38,66.65 180 bottom
U$25  23.06,73.91 90 bottom
U$26  91.95,38.89 0 top
U$35  94.89,20.85 0 bottom
U$36  95.15,31.47 180 bottom
U$37  88.8,22.02 180 bottom
U$39  71.12,105.71 0 top
U$40  73.71,98.04 180 bottom
U$43  60.66,88.14 90 top
U$44  54.15,88.19 90 top
U$45  14.58,91.19 90 top
U$46  14.63,97.18 90 top
U$47  14.58,105.11 90 top
U$48  14.43,113.03 90 top
U$49  14.78,121.36 90 top
X4  91.85,111.35 270 top
X10  27.13,3.56 180 top

### Tracks (layer width: path | path; a pad name or v marks a point on that pad's centre or on a via)
+3V3  (via drill 0.6, 0.8)
  Top 0.254: U$1.38 29.18,64.95 | 29.21,69.29 29.21,67.72 | 29.21,67.72 U$1.38 | U$1.38 29.21,67.69 29.21,67.72
  Top 0.305: SV5.10 28.96,84.07 29.67,83.36 U$1.10 29.67,77.62 27.94,75.89 | 29.18,64.95 27.48,63.25 26.67,63.25 26.36,62.94 26.36,61.16 SV8.11 | SV6.10 19.46,71.93 20.07,72.54 U$1.26 25.91,72.54 26.47,71.98 v26.47,71.02 27.23,70.26 29.21,70.26 29.21,69.29 v28.3,69.29 | U$19.VCCA 50.96,83.56 v50.39,84.12 | U$44.1 54.13,86.41 52.93,86.41 52.38,86.97 v50.9,86.97 v50.9,94.03 | U$20.2 57.51,75.79 56.54,76.76 v54.46,76.76 | 37.03,105.54 v37.03,106.83 | RLED2.1 59.64,114.15 v59.64,95.4 | SV7.8 43.94,73.56 U$1.57 29.26,73.56
  Top 0.61: 29.21,70.26 29.26,70.31 29.26,73.56 29.26,74.57 27.94,75.89 v26.72,77.11 | 37.03,105.54 U$22.2 37.03,96.11 37.19,95.96 37.24,95.96 v37.74,95.45
  Bottom 0.254: v28.3,69.29 28.3,67.33 U$24.1
  Bottom 0.305: U$25.1 23.75,72.51 25.2,71.07 26.42,71.07 v26.47,71.02 | 78.44,92.81 78.92,93.29 | v50.9,86.97 50.39,86.46 v50.39,84.12 50.39,80.67 54.3,76.76 v54.46,76.76 | 37.8,94.79 50.14,94.79 v50.9,94.03 | v59.64,95.4 59.59,95.35 59.59,94.79
  Bottom 0.406: 26.52,77.17 26.67,77.17 v26.72,77.11 | v37.03,106.83 38.35,106.83 40.23,108.71 40.23,110.13 38.2,112.17 35.53,112.17 J3.2
  Bottom 0.61: v37.74,95.45 37.74,94.84 37.8,94.79 | v26.72,77.11 26.57,77.11 25.91,77.78
  Bottom 1.016: 37.8,94.79 23.22,94.79 17.48,89.05 17.48,86.06 21.54,82.14 25.91,77.78 26.52,77.17 | U$23.1 28.91,79.4 26.67,77.17
  Bottom 2.54: 37.8,94.79 59.59,94.79 77.42,94.79 78.92,93.29 84.23,87.99 J4.PWR
+5V  (via drill 0.6, 0.8, 1.3)
  Top 0.305: 66.45,83.52 65.8,83.56 U$19.VCCB 59.75,83.56 59.23,84.07 59.23,85.16 U$43.1 | SV6.3 16.76,80.77 18.85,80.77 23.57,76.05 U$1.19 26.42,76.05 26.87,75.59 v26.87,74.12
  Top 0.406: U$12.6 v60.55,45.06
  Top 0.61: 72.85,77.42 73,77.8 73.76,78.33 72.39,79.7 72.39,98.15 | U$39.VCC 72.39,98.15 | v70.41,98.15 72.39,98.15 | 66.45,83.52 68.58,83.52 70.1,81.99 70.1,80.16 71.04,79.22 71.65,79.22 72.19,78.69
  Top 0.813: R1_5.1 64.21,50.39 61.47,53.14 58.42,53.14 56.9,51.61 56.9,49.05 L1_5.B | v12.19,56.49 12.09,56.59 JP1.2 JP2.2 | v12.19,66.85 12.09,66.75 JP4.2 JP3.2
  Top 1.016: L1_5.B 56.87,48.84 55.68,47.65 v54,46.38
  Top 1.778: v50.29,48.16 55.17,48.16 55.68,47.65
  Top 2.54: 54.56,50.6 54.56,53.65 61.57,60.66 67.26,60.66 75.08,68.22 75.08,75.72 73,77.8 72.19,78.69
  Bottom 0.305: U$6.1 28.12,75.36 v26.87,74.12
  Bottom 0.61: U$40.1 70.51,98.04 v70.41,98.15 | 11.33,79.55 10.72,80.16 10.72,87.02 10.67,87.07 10.67,87.17
  Bottom 0.813: SV6.3 10.67,79.6
  Bottom 1.016: v60.55,45.06 58.88,46.79 55.93,46.79 v54,46.38
  Bottom 1.27: U$16.1 55.98,39.93 54.66,41.25 54,42.01 v54,46.38
  Bottom 1.778: SENSOR5.3 10.57,92.25 10.67,92.35 | 10.67,92.35 10.67,88.09 10.67,87.17 | 44.81,48.16 v50.29,48.16 | 10.67,92.35 10.67,100.28 | 10.67,100.28 5.49,100.28 SENSOR4.3 | SENSOR3.3 10.67,108.81 | 10.67,108.81 10.67,100.28 | SENSOR2.3 10.62,117.09 10.67,117.04 | 10.67,117.04 10.67,108.81 | SENSOR1.3 8.33,125.17 10.67,122.83 10.67,117.04
  Bottom 1.93: 44.81,48.16 44.55,48.16 35.97,39.57 15.29,39.57 12.19,42.67 v12.19,56.49 v12.19,66.85 12.19,76.2 10.67,77.72 10.67,79.6 10.67,88.09
  pour Top (no thermals): 53.44,51.82 53.44,43.08 56.9,43.08 56.9,45.92 57.71,46.74 57.71,51.21 57.76,51.21 57.76,52.02 55.63,52.02 55.63,51.66
+7V  (via drill 0.6, 0.9)
  Top 0.254: L1_7.B 55.07,17.27 56.49,17.48
  Top 0.61: 39.78,22.35 39.78,22.38 v39.67,22.38 U$2.VS | COUT7.+ 50.19,18.14 50.19,22.35 48.26,22.35 45.11,22.35 45.09,22.38 | D5.C D4.C 9.81,23.58 v10.31,24.08
  Top 0.813: D7.C 50.14,18.09 50.19,18.14 | D8.C 48.2,22.41 48.26,22.35
  Top 1.422: U$8.2 59.44,12.9 56.49,17.48
  Top 1.676: 45.11,22.35 39.7,22.35 v39.67,22.38
  Bottom 0.61: v10.31,24.08 12.75,24.08 17.02,19.81 27.84,19.81 37.29,19.81 39.83,22.35 39.7,22.35 v39.67,22.38
  Bottom 0.813: U$5.1 28.07,20.04 27.84,19.81
  pour Top (no thermals): 58.52,16.46 58.52,23.16 41.35,23.16 41.4,20.68 41.4,20.52 49.17,20.52 49.28,11.89 50.8,11.79
+12V  (via drill 0.6, 1.4)
  Top 0.813: L1_12.2 98.86,26.7 v100.28,26.7
  Top 1.676: COUT12.+ 94.71,15.72 | 97.9,26.56 L1_12.2
  Top 2.54: 97.9,26.56 97.79,26.53 97.79,18.49 96.49,17.2 | 96.49,17.2 COUT12.+ | v97.84,15.54 97.84,15.85 96.49,17.2
  Bottom 0.813: U$36.2 100.28,28.4 v100.28,26.7 100.28,23.29 96.57,20.85 U$35.1
  Bottom 2.54: J2.PWR 86.79,4.95 83.82,7.92 83.82,11.28 88.09,15.54 v97.84,15.54
  pour Top (no thermals): 99.67,24.99 99.67,14.02 93.27,14.02 93.27,22.56 96.01,25.3 99.36,25.3
GND  (via drill 0.6, 0.7, 1.1, 1.3, 1.4, 1.5)
  Top 0.254: 30.68,62.48 U$1.41 30.68,69.44
  Top 0.305: U$4.PAD 68.25,9.12 v65.33,4.67 | 5.28,114.61 SENSOR2.2 | SV5.9 30.18,86.77 U$1.9 30.18,77.78 v31.39,76.56 | 30.68,62.48 30.07,61.87 30.07,59.89 SV8.8 | SV6.4 18.14,79.5 18.95,79.5 22.89,75.56 U$1.20 25.63,75.56 26.01,75.34 26.01,73.05 | SV6.9 16.66,73.05 U$1.25 26.01,73.05 | 26.01,73.05 26.95,73.05 v27.43,72.56 | U$44.2 v54.15,91.54 | U$19.GND 60.69,78.33 59.54,78.33 58.57,79.3 58.57,87.38 60.58,89.39 U$43.2 60.66,91.34 v60.6,91.39 61.57,92.35 61.57,111.66 64.01,114.1 69.55,114.1 75.03,119.58 POWER.C | 30.68,69.44 v31.7,70.46 | LED1.C 27.48,42.98 v27.64,43.13 | 76.2,103.94 76.1,103.94 | U$2.GND U$2.SA
  Top 0.406: U$26.4 92.92,35.47 94.13,34.27 | COUT5.2 54.76,39.65 54.76,36.98 56.13,35.61 CIN5.2 58.54,36.8 59.03,37.29 59.03,38.6 U$12.1 58.1,38.8 v56.08,36.78 | R2_5.2 61.62,40.18 61.16,39.73 U$12.4 | U$49.2 5.36,122.76 SENSOR1.2 | U$48.2 5.36,114.43 SENSOR2.2 | U$47.2 5.46,106.5 SENSOR3.2 | U$46.2 8.36,98.58 7.62,97.84 5.38,97.84 SENSOR4.2 | U$45.2 14.63,92.64 11.26,92.64 8.23,89.61 5.33,89.61 SENSOR5.2 | 75.29,82.91 v74.98,83.21
  Top 0.61: 94.13,34.27 94.13,33.05 91.39,29.79 v91.39,26.54 | 84.75,26.54 D1_12.- 84.28,26.44 84.38,26.54 | 74.93,98.15 U$39.GND2 74.93,103.94 | 74.93,98.15 74.93,83.26 v74.98,83.21 | 74.93,103.94 71.93,103.94 71.02,102.72 71.02,101.13 U$39.GND 71.12,100.99 71.02,100.89 | v77.42,98.15 74.93,98.15 | 25.5,10.77 D6.A 25.4,10.66 25.4,9.2 24.43,8.23 13.56,8.23 13.11,7.78 D3.A | D2.A 28.09,10.88 | D1.A 39.73,4.52 42.39,7.19 | 74.93,103.94 76.1,103.94 | 76.2,103.94 88.55,103.94 X4.5
  Top 0.813: CIN7.2 72.32,15.24 72.32,14.46 71.81,13.95 U$4.6 | 69.39,9.12 67.36,7.09 65.23,7.09 D1_7.- | SW_1.1 50.28,105.41 | 50.28,105.41 50.28,96.71 46.99,93.42 46.99,91.14 v46.89,91.03 | v86.36,23.98 84.28,23.98 | 26.36,21.89 U$2.GNDPAD v23.52,24.54 | U$7.2 50.08,105.61 50.28,105.41 | 25.5,10.77 28.31,10.77 D2.A | 28.09,10.88 28.09,15.93 28.19,16.03
  Top 1.016: D1_12.- 84.28,25.43 | 84.29,22.73 84.29,23.11 84.29,23.12 | v84.41,22.08 84.41,21.85 84.52,21.73 | U$2.GND 28.19,16.03 U$2.GND3
  Top 1.27: U$2.GND 33.35,16.03 34.75,14.63
  Top 1.676: COUT12.- | CIN5.2 58.54,35.58
  Top 1.778: CIN12.2 84,48.94 | 84.06,26.29 D1_12.- | 73.15,16.76 73.15,16.07 72.32,15.24 | 34.75,14.63 34.95,14.63 42.39,7.19 45.31,4.27 50.65,4.27 51.11,3.8
  Top 1.93: v66.24,39.62 64.67,39.62 R2_5.2 | v24.64,35.97 27.64,38.96 v27.64,43.13 | 82.7,49.33 83.87,49.33 CIN12.2
  Top 2.54: 81.38,48.94 81.2,48.94 | 81.41,26.16 81.28,26.16 78.49,28.96 78.49,46.23 81.33,49.07 | 81.41,26.16 84.18,26.16 D1_12.- | 84.28,25.43 84.28,25.12 84.28,23.98 84.29,23.12 84.29,22.73 84.29,22.44 v84.41,22.08 84.52,21.73 85.81,17.74 85.72,17.65 85.73,17.65 COUT12.- 87.96,11.7 J2.GNDBREAK 93.01,6.65 J2.GND | 81.41,26.16 83.82,23.75 | D1_7.- 65.2,5.82 63.17,3.79 60.66,3.79 U$9.1 51.33,3.76 51.11,3.8 COUT7.- | v73.15,20.42 73.15,16.76 | 81.33,49.07 81.33,48.99 81.38,48.94 | 81.38,48.94 81.38,49.12 | 81.38,49.12 81.58,49.33 v81.69,49.33 82.7,49.33 | 81.38,49.12 81.33,49.07
  Bottom 0.254: 31.7,68.48 31.7,66.73 U$24.2
  Bottom 0.305: 90.65,66.43 90.65,66.83 90.63,66.85 | v31.39,76.56 31.39,76.61 32.92,78.13 | v54.15,91.54 54.15,90.78 53.8,90.42 | v60.6,91.39 60.6,90.83 61.01,90.42 | 5.28,114.61 SENSOR2.2
  Bottom 0.406: 31.75,70.51 v31.7,70.46 32.05,70.1 34.14,70.1 35.18,71.14 U$3.2
  Bottom 0.61: v74.98,83.21 74.42,82.65 | U$40.2 77.32,98.04 v77.42,98.15 | U$6.2 v27.43,72.56 25.81,72.56 U$25.2 | J3.3 34.16,106.66 35.97,104.85 41.45,104.85 46.63,110.03 50.13,110.03 SW_1.1
  Bottom 0.813: J1.GNDBREAK 90.58,62.43 90.22,62.79 | v46.89,91.03 46.89,90.58 47.04,90.42 | 9.14,55.68 9.14,53.65 9.35,53.44 9.35,58.73 9.14,58.93 | JP1.3 9.14,59.13 | JP4.3 8.94,69.29 9.14,69.09 | v91.39,26.54 88.82,23.98 v86.36,23.98 | U$5.2 23.57,23.72 v23.52,24.54
  Bottom 1.016: U$37.1 84.47,22.02 v84.41,22.08 | 70.1,20.42 70.1,21.34 72.24,23.47 72.24,22.25 71.32,21.34 | 46.89,89.66 46.89,89.43 | 46.89,90.42 46.89,89.66 | 46.89,89.66 34.14,76.91 | U$23.2 31.73,79.32 32.92,78.13 34.14,76.91 | 34.14,76.91 31.7,74.47 31.7,72.54 | 31.7,68.48 v31.7,70.46 31.7,72.54 | U$6.2 31.68,72.56 31.7,72.54 | C1.- 80.67,61.77 81.28,62.38
  Bottom 1.676: 72.85,44.2 73.15,43.89
  Bottom 1.778: 2.13,85.04 2.13,89.61 | 2.13,89.61 2.13,98.15 | 2.13,98.15 2.13,106.07 | 2.13,106.07 2.13,114.91 | 2.13,114.91 2.13,122.53 | 2.13,122.53 2.13,124.66 | SENSOR1.2 2.23,122.63 2.13,122.53 | 5.28,114.61 2.44,114.61 2.13,114.91 | SENSOR3.2 2.34,106.27 2.13,106.07 | SENSOR5.2 2.23,89.71 2.13,89.61 | SENSOR4.2 2.29,97.99 2.13,98.15
  Bottom 1.93: v65.33,4.67 65.23,15.85 69.8,20.42 70.1,20.42 v73.15,20.42 | 2.13,85.04 2.13,84.94 6.71,80.37 6.71,77.11 9.14,74.68 9.14,69.09 9.14,59.13 9.14,58.93 9.14,55.68 9.14,41.15 14.17,36.12 24.49,36.12 v24.64,35.97 | v27.64,43.13 34.49,43.13 | 89.86,62.74 90.02,62.59
  Bottom 2.184: 89.92,62.48 90.02,62.59 90.22,62.79
  Bottom 2.54: J1.GNDBREAK 87.48,62.43 | 87.48,62.43 86.51,62.43 73.15,49.07 73.15,43.89 v73.15,20.42 | 72.85,44.2 70.81,44.2 v66.24,39.62 63.4,36.78 v56.08,36.78 | J1.GNDBREAK 93.65,59.43 J1.GND 93.65,57.38 85.34,49.07 81.94,49.07 v81.69,49.33 | J1.GNDBREAK 90.65,66.43 | 90.63,66.45 90.63,66.85 90.63,76.2 88.65,78.18 | 88.65,78.18 86.36,80.47 76.61,80.47 74.42,82.65 66.65,90.42 61.01,90.42 53.8,90.42 47.04,90.42 46.89,90.42 | 88.65,78.18 93.95,83.49 J4.GND 93.95,89.69 J4.GNDBREAK | 34.49,43.13 34.49,43.43 43.23,52.17 54.66,52.17 64.87,62.38 81.28,62.38 87.43,62.38 87.48,62.43
  other vias: 70.41,9.14 71.93,9.14
  pour Top (no thermals): 71.27,11.38 72.34,11.38 72.34,10.36 73.56,10.36 73.56,7.72 68.48,7.72 64.52,1.65 50.52,1.55 50.62,5.08 58.8,5.08 61.57,5.11 64.31,7.92 66.85,7.92 66.9,10.46 71.22,10.57
  pour Top (no thermals): 53.85,40.23 53.85,36.37 55.47,34.75 58.52,34.75 59.13,35.36 59.13,36.58 59.26,36.78 59.23,39.01 57.91,39.01 56.69,40.23
  pour Top (no thermals): 65.02,40.44 65.02,38.2 61.16,38.2 61.21,40.03 61.37,40.44
  pour Top (no thermals): 32.72,27.03 32.72,28.04 28.04,28.24 27.84,28.24 25.2,28.04 20.12,28.04 20.07,25.65 22.76,25.65 22.56,15.65 32.51,15.85 32.51,16.87 30.48,16.87 30.48,26.82 30.28,27.03
  pour Top (no thermals): 49.58,6.3 46.33,6.3 35.31,17.78 31.09,17.73 31.65,17.73 18.95,17.63 19,14.58 21.95,14.53 24.99,14.43 24.99,13.41 28.04,13.41 28.04,14.43 28.8,14.43 32.97,14.48 45.36,1.57 49.66,1.52
  pour Bottom: 80.01,63.25 80.11,56.44 80.06,54.81 88.09,63.14
  pour Bottom (isolate 0.406, no thermals): 0.1,127.05 0.1,0.2 0,0.1 101.35,0.1 101.7,0.46 101.7,126.8 101.57,126.92 0.23,126.92
N$1
  Top 0.305: U$49.1 14.91,120.09 17.07,120.09 20.73,116.43 20.73,107.9 26.36,102.26 26.36,88.04 SV5.11 27.74,86.67 27.74,84.18 29.18,82.73 U$1.11
  Top 0.406: U$49.1 5.36,119.96 SENSOR1.1
N$2
  Top 0.305: 28.7,78.94 U$1.12 28.68,81.81 26.42,84.07 SV5.12 26.42,86.31 25.09,87.63 25.09,101.5 19.66,106.93 19.66,109.42 17.53,111.56 14.5,111.56 U$48.1
  Top 0.406: U$48.1 8.77,111.63 8.23,112.17 5.38,112.17 SENSOR2.1
N$3
  Top 0.305: 14.65,103.63 U$47.1 14.81,103.94 20.83,103.94 23.88,100.89 SV5.13 25.15,86.72 25.15,84.28 28.17,81.25 U$1.13
  Top 0.406: SENSOR3.1 14.55,103.73 U$47.1
N$4
  Top 0.305: 14.86,96.01 U$46.1 | U$1.14 27.69,80.57 23.98,84.28 23.98,85.34 SV5.14 23.72,85.6 23.72,86.41 22.61,87.53 22.61,92.76 19.91,95.45 14.3,95.45
  Top 0.406: SENSOR4.1 14.3,95.45 U$46.1
N$5
  Top 0.305: U$1.22 21.72,74.55 19.25,77.01 SV6.6 17.22,77.01 16,75.79 13.61,75.79 12.24,77.17 12.24,83.72 14.63,86.11 14.63,89.73 U$45.1
  Top 0.406: U$45.1 10.54,89.79 7.92,87.17 SENSOR5.1
N$6
  Top 0.305: U$1.1 34.19,79.81 36.68,82.3 37.8,82.3 40.59,85.09 40.59,86.51 SV5.1
N$7  (via drill 0.6, 0.7)
  Top 0.305: U$1.16 26.67,79.7 25.2,81.18 24.18,81.18 21.34,84.02 SV5.16
  Top 0.406: v31.24,92.91 31.24,100.18 32.97,101.91 v32.97,105.41
  Bottom 0.406: SV5.16 21.34,85.55 19.61,87.27 19.61,89.26 22.96,92.61 30.94,92.61 v31.24,92.91 | v32.97,105.41 30.12,105.41 27.23,108.31 27.23,112.78 29.06,114.61 31.9,114.61 32.92,113.59 32.92,112.29 J3.4
N$8  (via drill 0.6)
  Top 0.254: U$1.34 27.18,66.65 26.31,65.79 23.16,65.79
  Top 0.305: 23.16,65.79 21.23,63.86 SV8.15 21.23,60.2 22.55,58.88 v22.55,52.83 | U$19.A8 53.2,79 50.9,76.71 50.9,66.45 33.63,49.17 v22.55,49.17
  Bottom 0.305: v22.55,49.17 v22.55,52.83
N$9
  Top 0.254: U$1.33 26.67,67.06 26.16,66.55 23.06,66.55
  Top 0.305: 23.06,66.55 19.81,63.3 19.81,59.99 SV8.16 21.13,58.47 21.13,52.63 22.76,51 34.34,51 49.84,66.5 49.84,76.96 52.53,79.66 U$19.A7
N$10
  Top 0.305: U$1.17 24.08,77.06 22.66,78.49 22.66,79.76 19.05,83.36 16.82,83.36 SV6.1
N$11
  Top 0.305: U$1.2 33.68,80.06 36.78,83.16 37.44,83.16 38.71,84.43 38.71,85.04 SV5.2
N$12  (via drill 0.6)
  Top 0.254: U$1.43 31.67,63.42
  Top 0.305: 31.67,63.42 32.72,62.38 32.72,59.79 SV8.6 33.93,57.3 v30.28,53.65 | JP3.1 2.03,63.6 3.25,62.38 8.33,62.38 11.79,58.93 v14.83,58.93
  Bottom 0.305: v14.83,58.93 15.24,58.93 18.9,55.27 23.98,55.27 25.6,53.65 v30.28,53.65
N$13  (via drill 0.6)
  Top 0.406: U$39.V-2 68.58,112.62 v68.94,112.98 | v78.79,99.87 78.79,99.77 78.28,99.26 76.66,99.26 76.2,99.72 U$39.V-
  Bottom 0.406: v68.94,112.98 76.25,112.98 78.79,110.44 v78.79,99.87
N$14  (via drill 0.7)
  Top 0.305: U$1.15 27.18,80.06 22.61,84.63 22.61,86.72 SV5.15
  Top 0.406: v29.16,90.58 29.16,100.53 31.65,103.02 31.65,109.6
  Top 0.61: 31.65,109.6 31.65,109.7 J3.5
  Bottom 0.406: SV5.15 21.34,89.61 21.59,89.86 28.45,89.86 v29.16,90.58
N$15
  Top 0.305: U$1.64 37.59,77.06 38.61,78.08 38.61,80.67 40.28,82.35 SV7.1 45.82,85.6 51.51,85.6 52.9,84.2 U$19.A1
N$16  (via drill 0.7)
  Top 0.813: v67.06,13.72 67.67,14.33 69.19,12.8 69.19,12.07 U$4.8
  Bottom 0.813: CBOOT7.1 67.79,12.98 v67.06,13.72
  pour Top (no thermals): 66.4,19.81 66.5,15.67 69.39,12.93 69.39,11.28 69.52,11.15 63.32,11.15 63.27,19.76
N$17
  Top 0.305: U$1.63 38,76.56 39.42,77.98 39.42,79.96 40.49,81.03 43.79,81.03 SV7.2 45.16,82.4 48.31,82.4 48.82,82.91 U$19.A2
N$18  (via drill 0.7, 1.3)
  Top 0.61: 32.38,19.84 U$2.OUT1 33.04,19.81 37.03,19.81 38.81,18.03 v38.81,16.82 | D2.C 31.79,6.86 29.72,6.86 28.45,5.59 28.45,3.61 X10.2
  Top 0.813: D8.A 44.04,26.52 v42.16,24.64
  Bottom 0.61: 28.45,6.5 28.45,3.56
  Bottom 0.813: v42.16,24.64 42.16,20.17 v38.81,16.82
  Bottom 1.676: X10.2 28.45,3.61 28.45,6.5 v38.81,16.82
N$19  (via drill 1.3)
  Top 0.61: 33.98,21.08 33.96,21.11 U$2.OUT2 33.04,21.08 38.46,21.08 40.64,18.9 40.64,18.03 | D1.C 34.04,4.67 32.05,4.67 X10.1 | v41.55,15.39 41.55,16.1 40.64,17.02 40.64,18.03 | D7.A 40.69,18.09 40.64,18.03
  Top 0.813: 43.34,17.98 D7.A
  Bottom 1.676: X10.1 30.89,3.61 30.89,4.67 36.78,10.57 36.78,10.77 36.93,10.77 v41.55,15.39
N$20  (via drill 1.1)
  Top 0.61: 16.71,19.36 17.4,19.84 U$2.OUT4 | v17.42,11.53 18.54,10.92 D6.C | D5.A 16.64,16.51 16.43,16.51
  Top 1.016: v17.42,11.53 17.93,11.33 16.43,12.8 16.43,16.51 16.46,19.1 16.71,19.36
  Bottom 1.676: X10.3 25.86,6.81 21.13,11.53 v17.42,11.53
N$21  (via drill 1)
  Top 0.61: 13.92,21.53 16.41,21.53 16.87,21.08 19.99,21.08 U$2.OUT3
  Top 0.813: X10.4 20.83,6.04 D3.C | D4.A 13.92,21.53 v13.92,19.1
  Bottom 1.27: v13.92,19.1 13.92,11.43 17.17,8.18 20.68,8.18 23.16,5.69 23.16,3.71 X10.4
N$22
  Top 0.305: U$1.18 23.82,76.56 21.69,78.69 21.69,79.55 19.2,82.04 18.14,82.04 SV6.2
N$23
  Top 0.305: U$1.3 33.17,80.37 36.83,84.02 37.19,84.02 37.9,84.73 37.9,86.67 SV5.3
N$24
  Top 0.305: U$1.4 32.69,80.75 35.97,84.02 35.97,84.84 SV5.4
N$25  (via drill 0.6)
  Top 0.813: U$4.1 69.27,5.56 v67.74,4.04
  Bottom 0.813: v67.74,4.04 67.74,8.61 CBOOT7.2
N$26
  Top 0.305: U$1.5 32.18,81.1 35.26,84.18 35.26,86.77 SV5.5
N$27
  Top 0.305: U$1.6 31.67,81.71 34.04,84.07 SV5.6
N$28  (via drill 0.7)
  Top 0.61: U$4.4 73.08,4.8 70.31,2.03 v68.28,2.03
  Top 1.676: U$9.2 v59.72,8.23 U$8.1
  Bottom 0.61: v68.28,2.03 64.64,2.03 v59.72,8.23
N$29
  Top 0.305: U$1.62 38.56,76.05 40.18,77.67 40.18,79.15 40.79,79.76 42.52,79.76 SV7.3 43.43,79.81 44.7,81.08 48.56,81.08 49.74,82.25 U$19.A3
N$30
  Top 0.61: U$21.1 41,101.35 U$22.1 39.88,104.95 | 39.88,104.95 39.88,106.55 38.57,107.86 | 38.57,107.86 J3.1 | 46.43,111.45 42.16,111.45 38.57,107.86 | U$7.1 42.11,105.61 41.45,104.95 39.88,104.95
  Top 0.813: SW_1.3 55.22,110.18 51.87,113.54 48.51,113.54 46.43,111.45 | U$22.1
N$31
  Top 0.305: RLED.2 15.8,43.13 LED1.A
N$32
  Top 0.305: U$1.61 38.94,75.56 40.89,77.52 40.89,78.28 41.15,78.54 43.84,78.54 SV7.4 48.82,79.81 50.62,81.61 U$19.A4
N$33
  Top 1.016: Q1.3 Q1.2 Q1.1
  Top 1.93: Q1.1 87.89,33.68 D1_12.+ 85.12,30.07 L1_12.1
  pour Top (no thermals): 86.92,34.9 86.92,34.39 84.02,31.5 84.02,28.96 84.99,28.96 86.77,27.18 90.07,27.18 90.07,29.36 90.07,30.18 88.65,31.6 88.65,34.9
N$34
  Top 0.305: U$19.A5 55.08,80.92 51.41,80.92 48.01,77.52 48.01,67.51 46.28,65.79 44.65,65.79 43.48,64.62 42.62,64.62 SV7.15 40.84,64.57 39.17,66.24 39.17,68.33 37.44,70.05 U$1.50
N$35  (via drill 0.6)
  Top 0.305: v92.46,33.53 92.46,33.66 92.33,33.78 92.33,36.43 U$26.3
  Bottom 0.61: U$36.1 93.73,32.26 v92.46,33.53
  Bottom 1.016: U$37.2 92.33,22.02 | 92.33,22.02 U$35.2 | 92.33,22.02 92.33,23.52 93.32,24.51 93.32,31.06 U$36.1
N$36
  Top 0.406: U$12.7 59.87,44.42 59.38,44.91 59.38,46.53 60.6,47.75 60.6,48.66 L1_5.A
N$37  (via drill 0.8)
  Top 0.406: U$12.8 59.22,44.1 v58.12,45.21
  Bottom 0.813: v58.12,45.21 57.81,45.21 56.9,44.3 56.9,42.93 U$16.2
N$38
  Top 0.305: U$19.A6 51.87,80.31 48.82,77.27 48.82,67.11 46.28,64.57 SV7.16 43.84,63.3 41.15,63.3 38.46,65.99 38.46,68.22 37.13,69.55 U$1.49
N$39  (via drill 0.6)
  Top 0.305: U$19.B1 61.65,84.2 v62.48,85.04 | v62.79,76.5 62.79,71.63 61.57,70.41 56.69,70.41 34.75,48.46 34.75,36.78 v34.54,36.58 | 33.78,23.62 32.04,23.62 U$2.IN1 33.04,23.62 v36.42,23.62
  Bottom 0.305: v62.48,85.04 62.48,76.81 v62.79,76.5 | v34.54,36.58 34.54,32.36 37.34,29.57 37.34,24.54 v36.42,23.62
N$40
  Top 0.305: 61.47,44.3 61.47,43.38
  Top 0.406: R1_5.2 63.3,46.13 61.47,44.3 61.17,44 U$12.5 61.17,43.37 61.47,43.08 64.06,43.08 R2_5.1
  pour Top (no thermals): 63.4,46.33 61.16,44.09 61.16,42.88 65.02,42.88 65.02,46.33
N$41  (via drill 0.6)
  Top 0.305: U$19.B4 65.31,81.61 68.58,78.33 68.58,70.41 65.84,67.67 57.61,67.67 37.49,47.55 37.49,32.77 36.07,31.34 v33.12,31.34 | v17.42,22.4 20.99,22.4 U$2.IN4
  Bottom 0.305: v17.42,22.4 15.75,24.08 15.7,28.09 19.1,31.34 v33.12,31.34
N$42
  Top 0.305: U$19.B2 65.84,82.91 69.8,78.94 69.8,69.19 66.45,65.84 58.22,65.84 39.32,46.94 39.32,30.07 35.41,26.16 32.04,26.16 U$2.IN2 32.04,26.21
N$43
  Top 0.305: U$19.B3 65.57,82.25 69.19,78.64 69.19,69.8 66.14,66.75 57.91,66.75 38.41,47.24 38.41,32.41 36.32,30.33 17.88,30.33 15.6,28.04 15.6,26.26 16.92,24.94 19.99,24.94 U$2.IN3 18.82,24.92
N$44  (via drill 0.6)
  Top 0.305: U$19.B5 65.04,80.95 67.97,78.03 67.97,71.02 65.53,68.58 57.3,68.58 36.58,47.85 36.58,34.7 v36.37,34.49 | 32.09,24.99 U$2.ENA | 32.04,24.89 U$2.ENA | v39.62,24.94 39.6,24.92 U$2.ENA
  Bottom 0.305: v36.37,34.49 39.62,31.24 v39.62,24.94
N$45
  Top 0.305: 20.89,23.77 U$2.ENB | U$19.B6 64.78,80.31 67.36,77.72 67.36,71.63 65.23,69.49 57,69.49 35.66,48.16 35.66,35.76 31.6,31.7 17.48,31.7 14.12,28.35 14.12,24.79 15.19,23.72 19.94,23.72 U$2.ENB | 20.99,23.62 U$2.ENB
N$46
  Top 0.305: U$1.21 22.23,75.06 19.1,78.18 16.71,78.18 SV6.5
N$47  (via drill 0.6)
  Top 0.305: U$19.B7 63.6,79.66 v64.92,78.33 | v66.75,85.65 66.75,96.01 67.36,96.62 67.36,100.98 U$39.R1OUT
  Bottom 0.305: v64.92,78.33 64.92,83.82 v66.75,85.65
N$48  (via drill 0.6)
  Top 0.406: U$26.2 91.62,35.01 v90.88,34.27
  Bottom 1.422: RT12.1 87.63,37.52 v90.88,34.27
N$49  (via drill 0.6)
  Top 0.305: U$19.B8 62.73,79 v63.4,78.33 | v64.92,85.65 64.92,96.01 66.14,97.23 66.14,100.93 U$39.T1IN
  Bottom 0.305: v63.4,78.33 63.4,84.12 v64.92,85.65
N$51
  Top 0.406: U$26.7 91.62,42.73 92.91,44.02 92.91,46.43 CVCC12.2
N$52
  Top 0.406: RAJ12.1 96.93,34.72 94.13,37.52 91.29,37.52 90.88,37.11 90.88,36.58 U$26.1
  Top 0.61: CADJ12.2 99.5,41.91 100.23,41.17 100.23,36.8 RAJ12.1
N$53  (via drill 0.6)
  Top 0.61: v69.8,107.9 81.99,107.9 83.21,109.12 83.21,110.64 86.69,114.12 X4.2 | v69.8,103.63 69.8,101.08 U$39.T1OUT
  Bottom 0.61: v69.8,107.9 v69.8,103.63
N$54  (via drill 0.6)
  Top 0.406: U$26.5 92.92,42.38 v93.27,42.75
  Top 0.813: v89.26,43.2 87.33,43.2 RSNS12.1
  Top 1.016: Q1.8 Q1.7 Q1.6 Q1.5
  Top 2.184: Q1.5 82.39,38.27 RSNS12.1
  Bottom 0.406: v93.27,42.75 90.17,42.75 v89.26,43.2
N$55
  Top 0.406: U$26.6 92.27,40.53 91.69,39.95 90.47,39.95 88.44,37.92 88.07,37.92 Q1.4
N$56
  Top 0.305: U$20.1 54.66,74.73 52.83,76.56 52.83,77.62 53.54,78.33 55.09,78.33 U$19.OE
N$57
  Top 0.305: U$1.23 20.98,74.07 19.36,75.69 16.76,75.69 SV6.7
N$59
  Top 0.254: U$1.48 34.19,66.19 35.56,64.82
  Top 0.305: 35.56,64.82 37.59,64.82 39.06,63.35 39.06,61.16 SV8.1
N$61
  Top 0.305: U$1.24 20.37,73.56 19.46,74.47 SV6.8
N$62
  Top 0.406: U$39.C2-2 76.2,112.27 75.18,113.28 71.12,113.28 69.85,112.01 69.85,111 69.8,110.95 69.8,110.45 U$39.C2-
N$63
  Top 0.305: U$1.27 20.75,72.06 19.3,70.61 16.76,70.61 SV6.11
N$64
  Top 0.305: U$1.28 21.36,71.55 19.2,69.39 SV6.12
N$65
  Top 0.305: U$1.29 21.87,71.04 20.07,69.24 20.07,68.63 19.56,68.12 16.82,68.12 SV6.13
N$66
  Top 0.305: U$1.30 22.35,70.56 20.88,69.09 20.88,68.12 19.56,66.8 18.14,66.8 | 18.14,66.8 SV6.14 | 18.14,66.8 17.17,66.8 15.95,65.58 14.68,65.58 12.8,63.7 12.8,62.18 13.72,61.27 17.07,61.27 18.59,59.74 18.59,53.14 RLED.1
N$67  (via drill 0.6)
  Top 0.305: SV7.9 41.71,73.05 U$1.56 34.85,73.05 v33.73,71.93
  Bottom 0.305: v33.73,71.93 33.53,71.93 32.92,72.54 32.92,73.36 33.53,73.97 35.33,73.97 U$3.1
N$68
  Top 0.254: U$1.47 33.68,65.84 35.31,64.21
  Top 0.305: 35.31,64.21 36.73,64.21 37.8,63.14 37.8,59.79 SV8.2
N$69
  Top 0.254: U$1.46 33.17,65.43
  Top 0.305: 33.17,65.43 35.1,63.5 35.92,63.5 36.47,62.94 SV8.3
N$70  (via drill 0.6)
  Top 0.254: U$1.45 32.69,64.75
  Top 0.305: 32.69,64.75 35.2,62.23 35.2,59.84 SV8.4 36.47,55.37 v34.75,53.65 | JP2.1 4.27,51.82 14.02,51.82 v15.04,52.83
  Bottom 0.305: v15.04,52.83 17.68,52.83 19.71,50.8 19.71,49.38 22.15,46.94 31.5,46.94 33.12,48.56 33.12,52.02 v34.75,53.65
N$71  (via drill 0.6)
  Top 0.254: U$1.44 32.18,64.14
  Top 0.305: 32.18,64.14 33.93,62.38 SV8.5 33.93,60.15 35.36,58.73 35.36,56.29 v31.5,52.43 | JP1.1 6.1,54.25 v16.66,54.25
  Bottom 0.305: v16.66,54.25 23.16,54.25 24.99,52.43 v31.5,52.43
N$72
  Top 0.406: U$39.C2+2 74.93,111.81 74.32,112.42 71.68,112.42 71.12,111.86 U$39.C2+
N$73  (via drill 0.6)
  Top 0.254: U$1.42 31.19,61.32
  Top 0.305: 31.19,61.32 SV8.7 31.5,61.01 31.5,60.15 32.72,58.93 32.72,57.91 29.67,54.86 v26.42,54.86 | JP4.1 8.33,64.21 12.39,60.15 15.85,60.15 v16.87,59.13
  Bottom 0.305: v16.87,59.13 19.71,56.29 24.99,56.29 v26.42,54.86
N$74
  Top 0.254: U$1.40 30.18,63.6
  Top 0.305: 30.18,63.6 28.91,62.33 28.91,61.16 SV8.9
N$75
  Top 0.254: U$1.39 29.67,64.16
  Top 0.305: 29.67,64.16 27.64,62.13 27.64,59.79 SV8.10
N$76
  Top 0.305: U$1.54 38.94,72.06 41.35,69.65 SV7.11
N$77
  Top 0.305: U$1.53 38.53,71.55 41.6,68.48 43.94,68.48 SV7.12
N$78
  Top 0.305: RLED2.2 69.7,121.36 POWER.A
N$79
  Top 0.305: U$1.7 31.19,82.4 32.82,84.02 32.82,86.67 SV5.7
  Top 0.61: U$21.2 40.84,93.83 39.06,92.05 33.22,92.05 31.55,90.37 31.55,88.04 SV5.7
N$81
  Top 0.305: U$1.52 38.08,71.04 40.64,68.48 40.64,67.77 41.3,67.11 SV7.13
N$82
  Top 0.305: U$1.51 37.74,70.56 39.98,68.33 39.98,67.36 41.35,65.99 43.99,65.99 SV7.14
N$83
  Top 0.254: U$1.35 27.69,66.4 26.47,65.18
  Top 0.305: 26.47,65.18 23.98,65.18 22.55,63.75 22.55,59.79 SV8.14
N$87
  Top 0.61: U$39.R1IN 68.58,105.16 69.8,106.38 83.21,106.38 85.04,108.2 85.04,110.03 86.26,111.25 88.59,111.25 88.7,111.35 X4.3
N$90
  Top 0.305: U$1.31 22.91,70.05 21.74,68.89 21.74,67.82 19.46,65.53 16.76,65.53 SV6.15
N$91
  Top 0.305: U$1.8 30.68,83.01 31.5,83.82 SV5.8
N$93
  Top 0.305: U$1.32 23.27,69.55 22.45,68.73 22.45,67.16 19.56,64.26 18.14,64.26 SV6.16
N$94
  Top 0.305: U$1.55 40.13,72.54 41.71,70.97 43.89,70.97 SV7.10
N$95
  Top 0.305: U$1.58 41.91,74.07 SV7.7
N$96
  Top 0.305: U$1.59 39.9,74.55 41.35,76 43.84,76 SV7.6
N$97
  Top 0.305: U$1.60 39.34,75.06 41.5,77.22 42.52,77.22 SV7.5
SCL  (via drill 0.6)
  Top 0.254: U$1.37 28.68,65.61 27.03,63.96
  Top 0.305: 27.03,63.96 25.7,63.96 25.09,63.35 25.09,59.79 SV8.12 | v85.9,73.1 I2C.1
  Bottom 0.305: SV8.12 26.26,58.52 26.26,57.1 27.89,55.47 41.25,55.47 51.66,65.89 78.69,65.89 v85.9,73.1
SDA  (via drill 0.6)
  Top 0.254: U$1.36 28.17,67.13 28.19,67.11 28.19,65.99 26.77,64.57
  Top 0.305: 26.77,64.57 24.84,64.57 23.82,63.55 23.82,61.16 SV8.13 23.77,60.2 25.09,58.88 25.09,57.61 26.26,56.44 v29.01,56.44 | v84.89,75.69 98.15,75.69 I2C.2
  Bottom 0.305: v29.01,56.44 29.11,56.54 40.59,56.54 51.46,67.41 76.61,67.41 v84.89,75.69
V+  (via drill 0.6)
  Top 0.305: 59.94,38.73 U$12.2 U$12.3 60.52,36.43 CIN5.1
  Top 0.406: CVCC12.1 90.24,43.84 90.88,43.2 90.88,41.38 U$26.8 89.55,41.29 | RSNS12.2 85.6,46.28 86.87,47.55 86.87,49.13 CIN12.1
  Top 0.61: 89.55,41.29 v89.26,41.58 | v95.76,40.36 96.16,40.36 96.19,40.39 96.69,40.39 | 96.57,40.77 96.57,42.06 CADJ12.1 96.69,40.39 | 96.69,40.39 96.69,39.02 RAJ12.2 | v88.44,45.24 88.44,45.64 | C1.+ 76.03,58.15 76.03,57.57 | 86.87,57.73 J1.PWR
  Top 0.813: U$4.7 70.54,13.44 69.52,14.45 CIN7.1
  Top 1.016: CIN12.1 87.6,49.2 CVCC12.1 | C1.+ 79.81,57.56 75.64,56.92
  Top 1.676: 86.8,51.82 86.87,51.82 86.87,49.27 CIN12.1 | 69.19,17.68 69.19,16.18 CIN7.1
  Top 2.54: 86.87,51.82 86.87,57.73 76.2,57.73 76.03,57.57 69.19,50.72 69.19,35.97 | 69.19,35.97 69.19,17.68 | CIN5.1 61.4,35.56 68.78,35.56 69.19,35.97
  Bottom 0.61: v89.26,41.58 89.26,40.77 89.66,40.36 v95.76,40.36 | RT12.2 87.68,43.66 88.44,44.42 v88.44,45.24
  pour Top (no thermals): 86.06,50.39 86.06,47.5 84.48,45.92 84.48,43.94 86.31,43.94 86.92,44.55 91.19,44.55 91.19,46.89 88.6,49.48 88.6,50.6 88.54,50.65 86.06,50.65 86.06,50.5
  pour Top (no thermals): 59.84,38.96 59.84,36.68 60.96,35.51 61.37,35.51 61.42,35.56 61.42,36.68 60.5,37.49 60.5,38.96
  pour Top (no thermals): 89.66,41.2 90.93,42.47 90.98,41.2

### Text on the board
Dimension: RESET
tPlace: 3 | 1 | 16 | 2 | 64 | 17 | 18 | 3.3V IN | SDA | SCL | LEFT | Unregulated | 32 | 48 | 49 | RIGHT | 33 | Team 16: Project Minotaur | TOP | PCB 1 of 2 | Scott Stack, Neil Kumar, Jon Roose, John Hubberts | left motor | - | + | - | + | right motor | 12V OUT